# EAGLE schematic Room-Monitoring V.1.0 (EAGLE 7.2.0), part 1 of 2
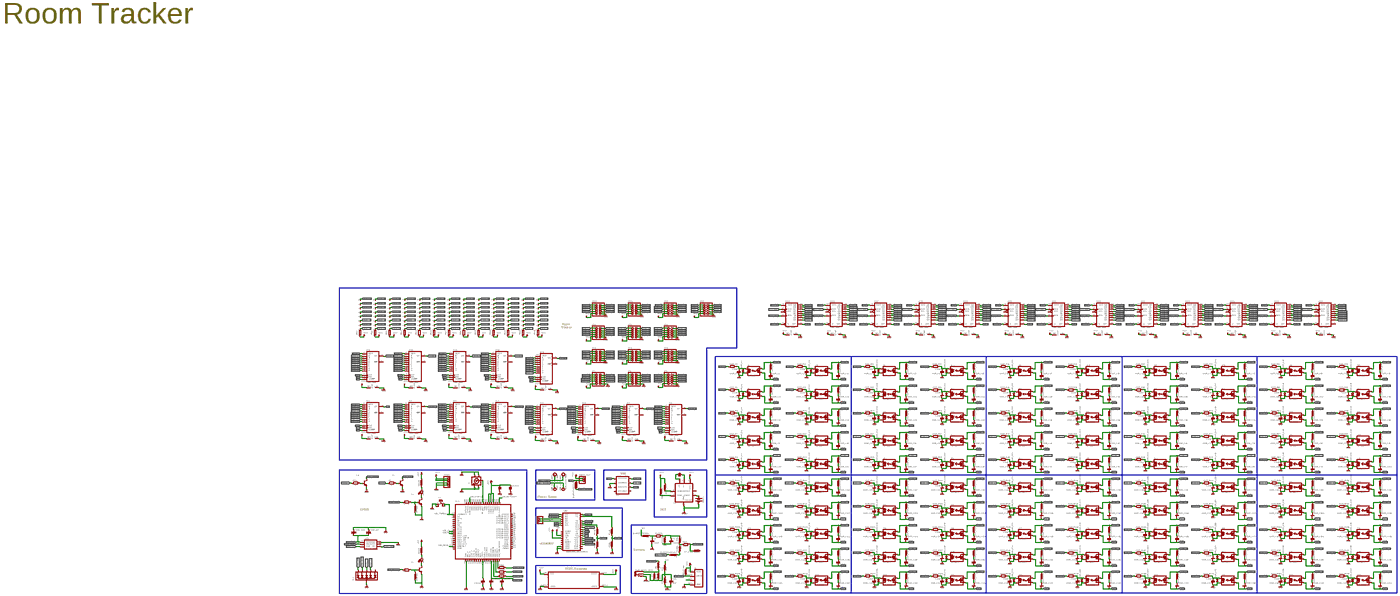
[diagram p0: schematic, sheet 1, overview]
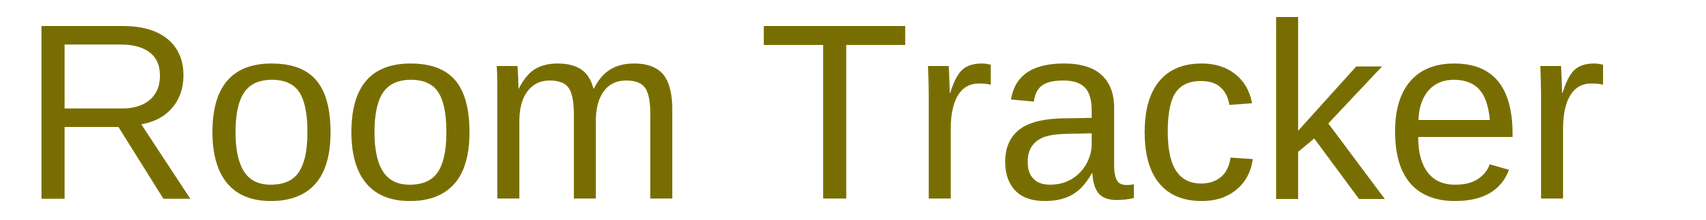
[diagram p1: schematic, sheet 1, part 1 of 5]
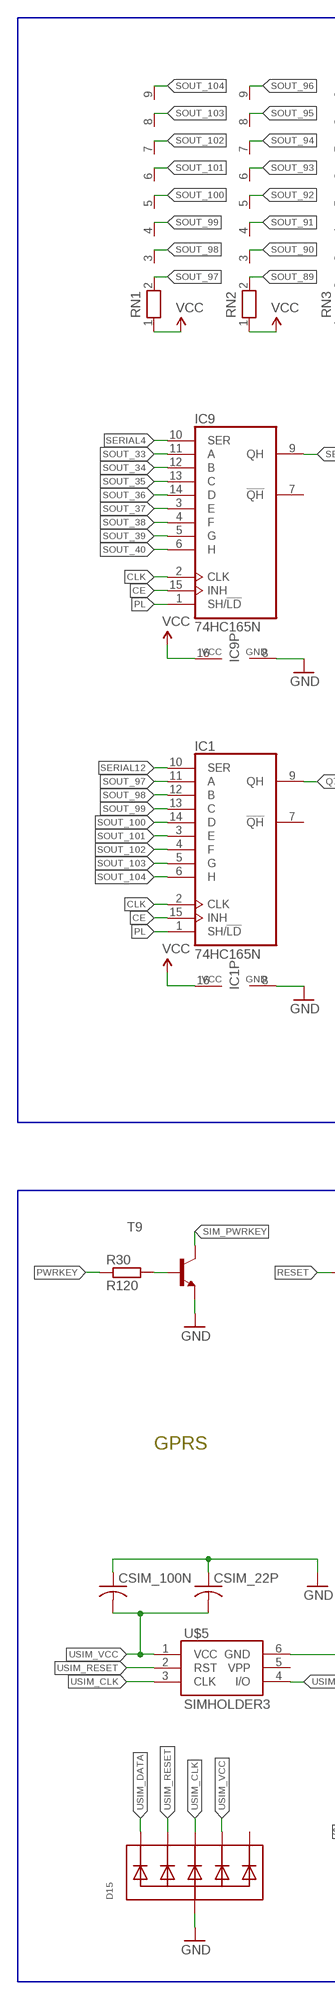
[diagram p2: schematic, sheet 1, part 2 of 5]
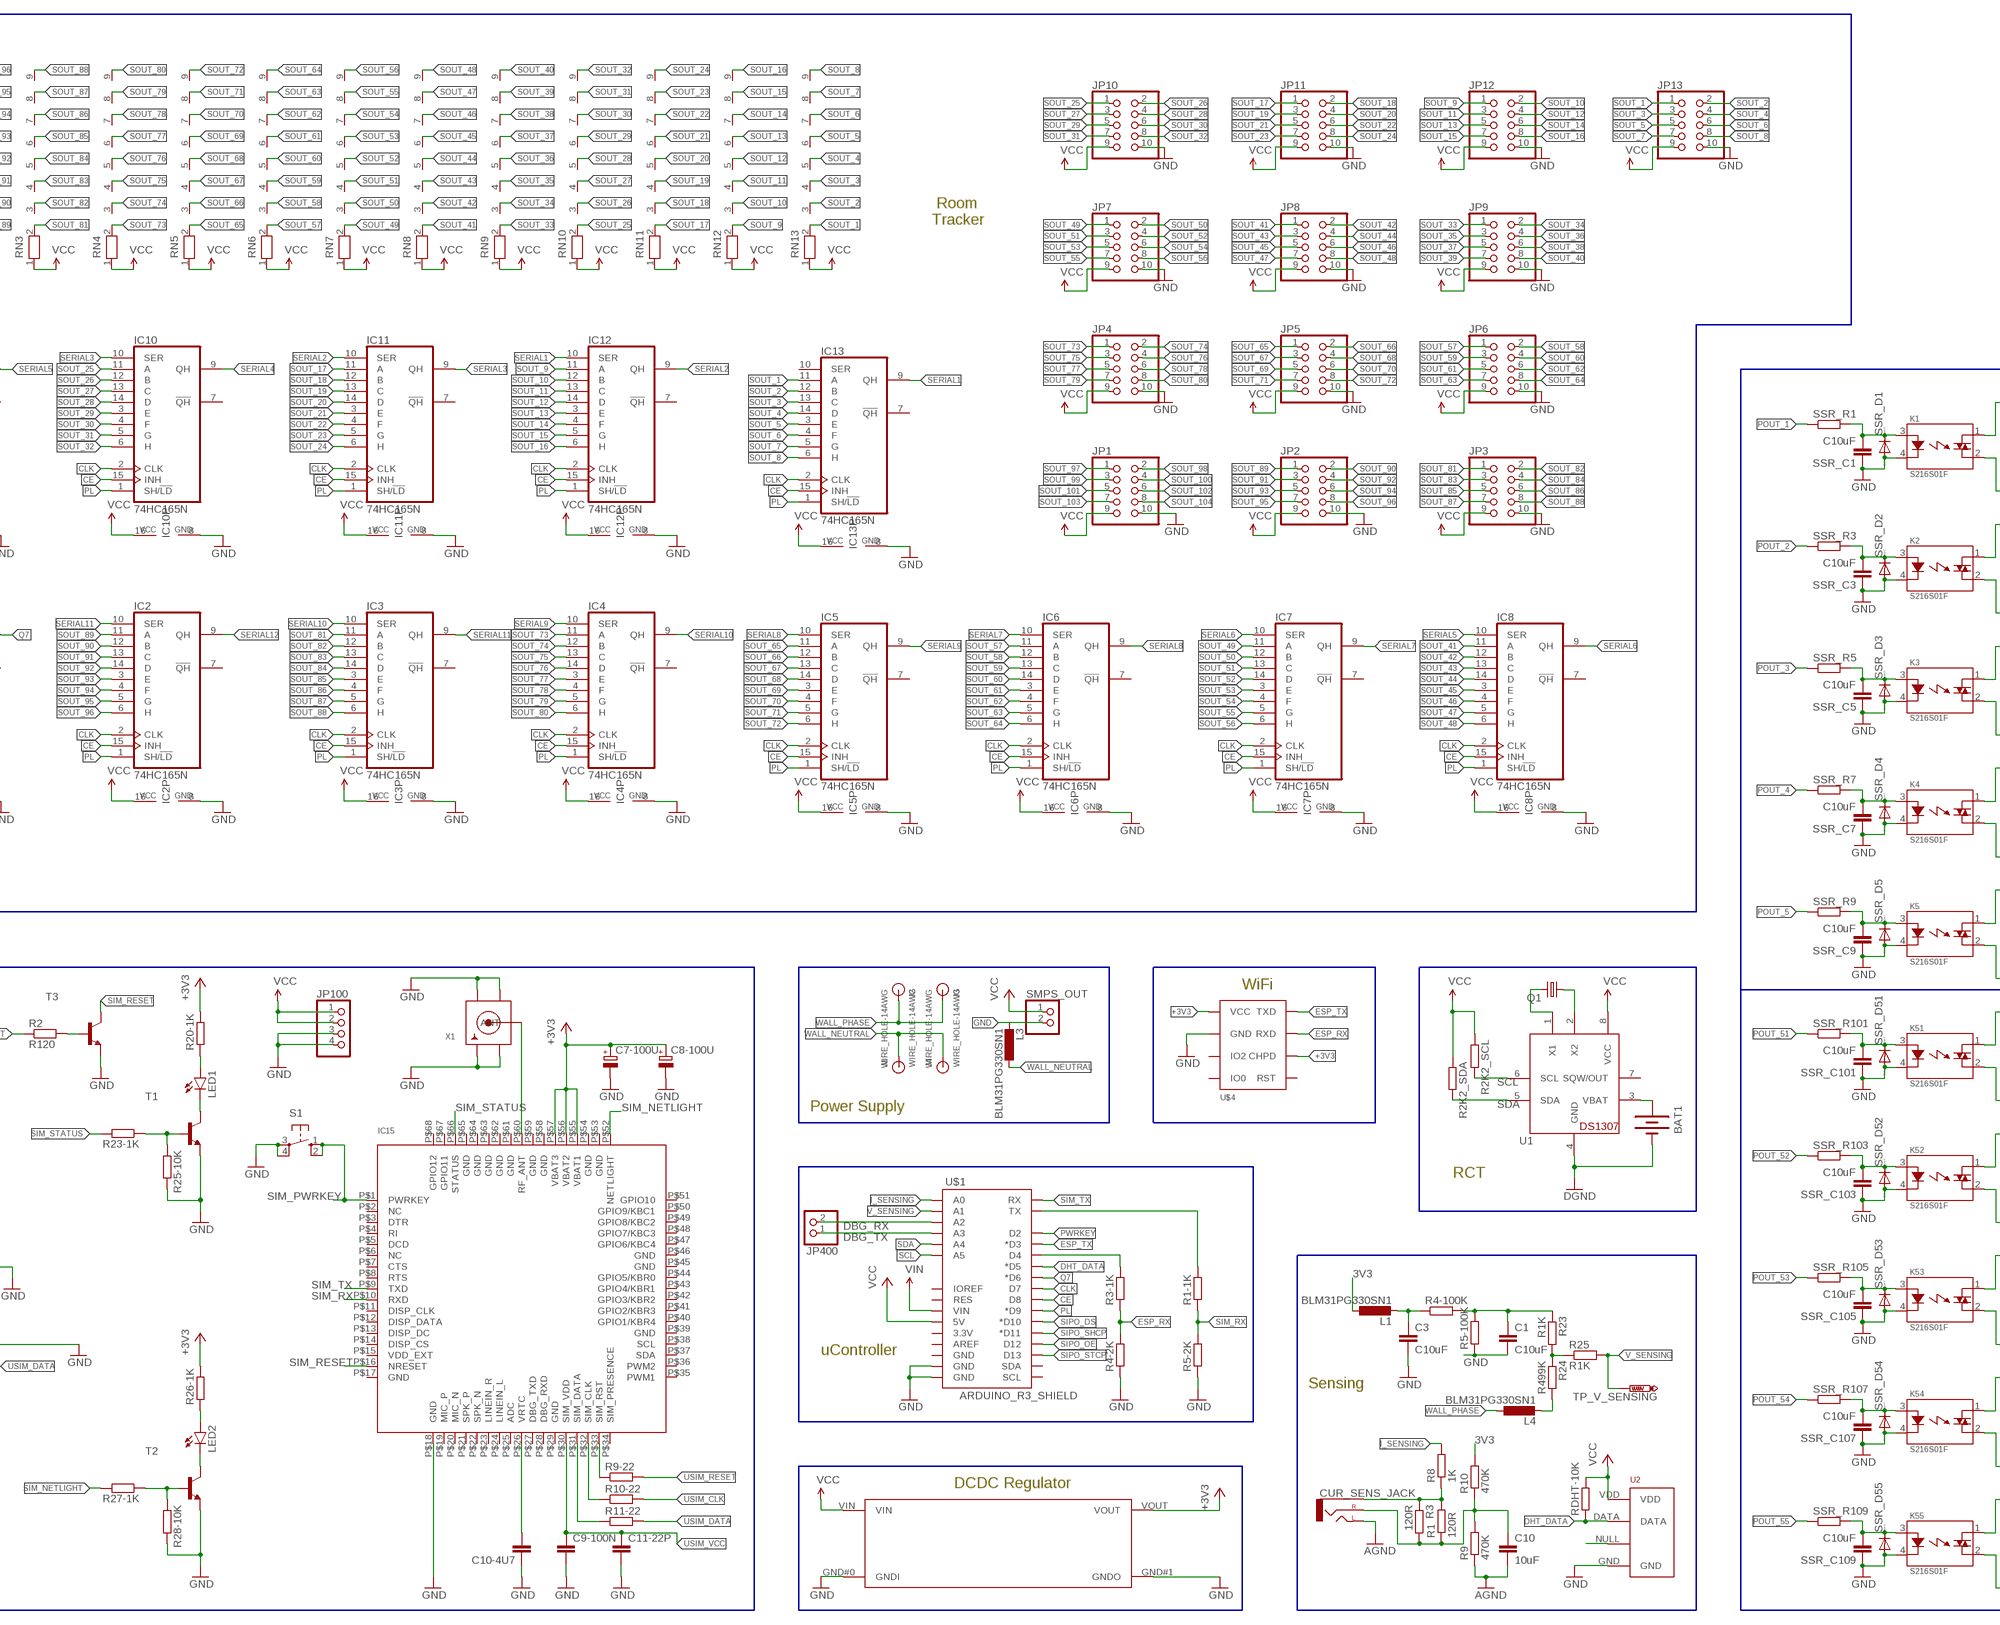
[diagram p3: schematic, sheet 1, part 3 of 5]
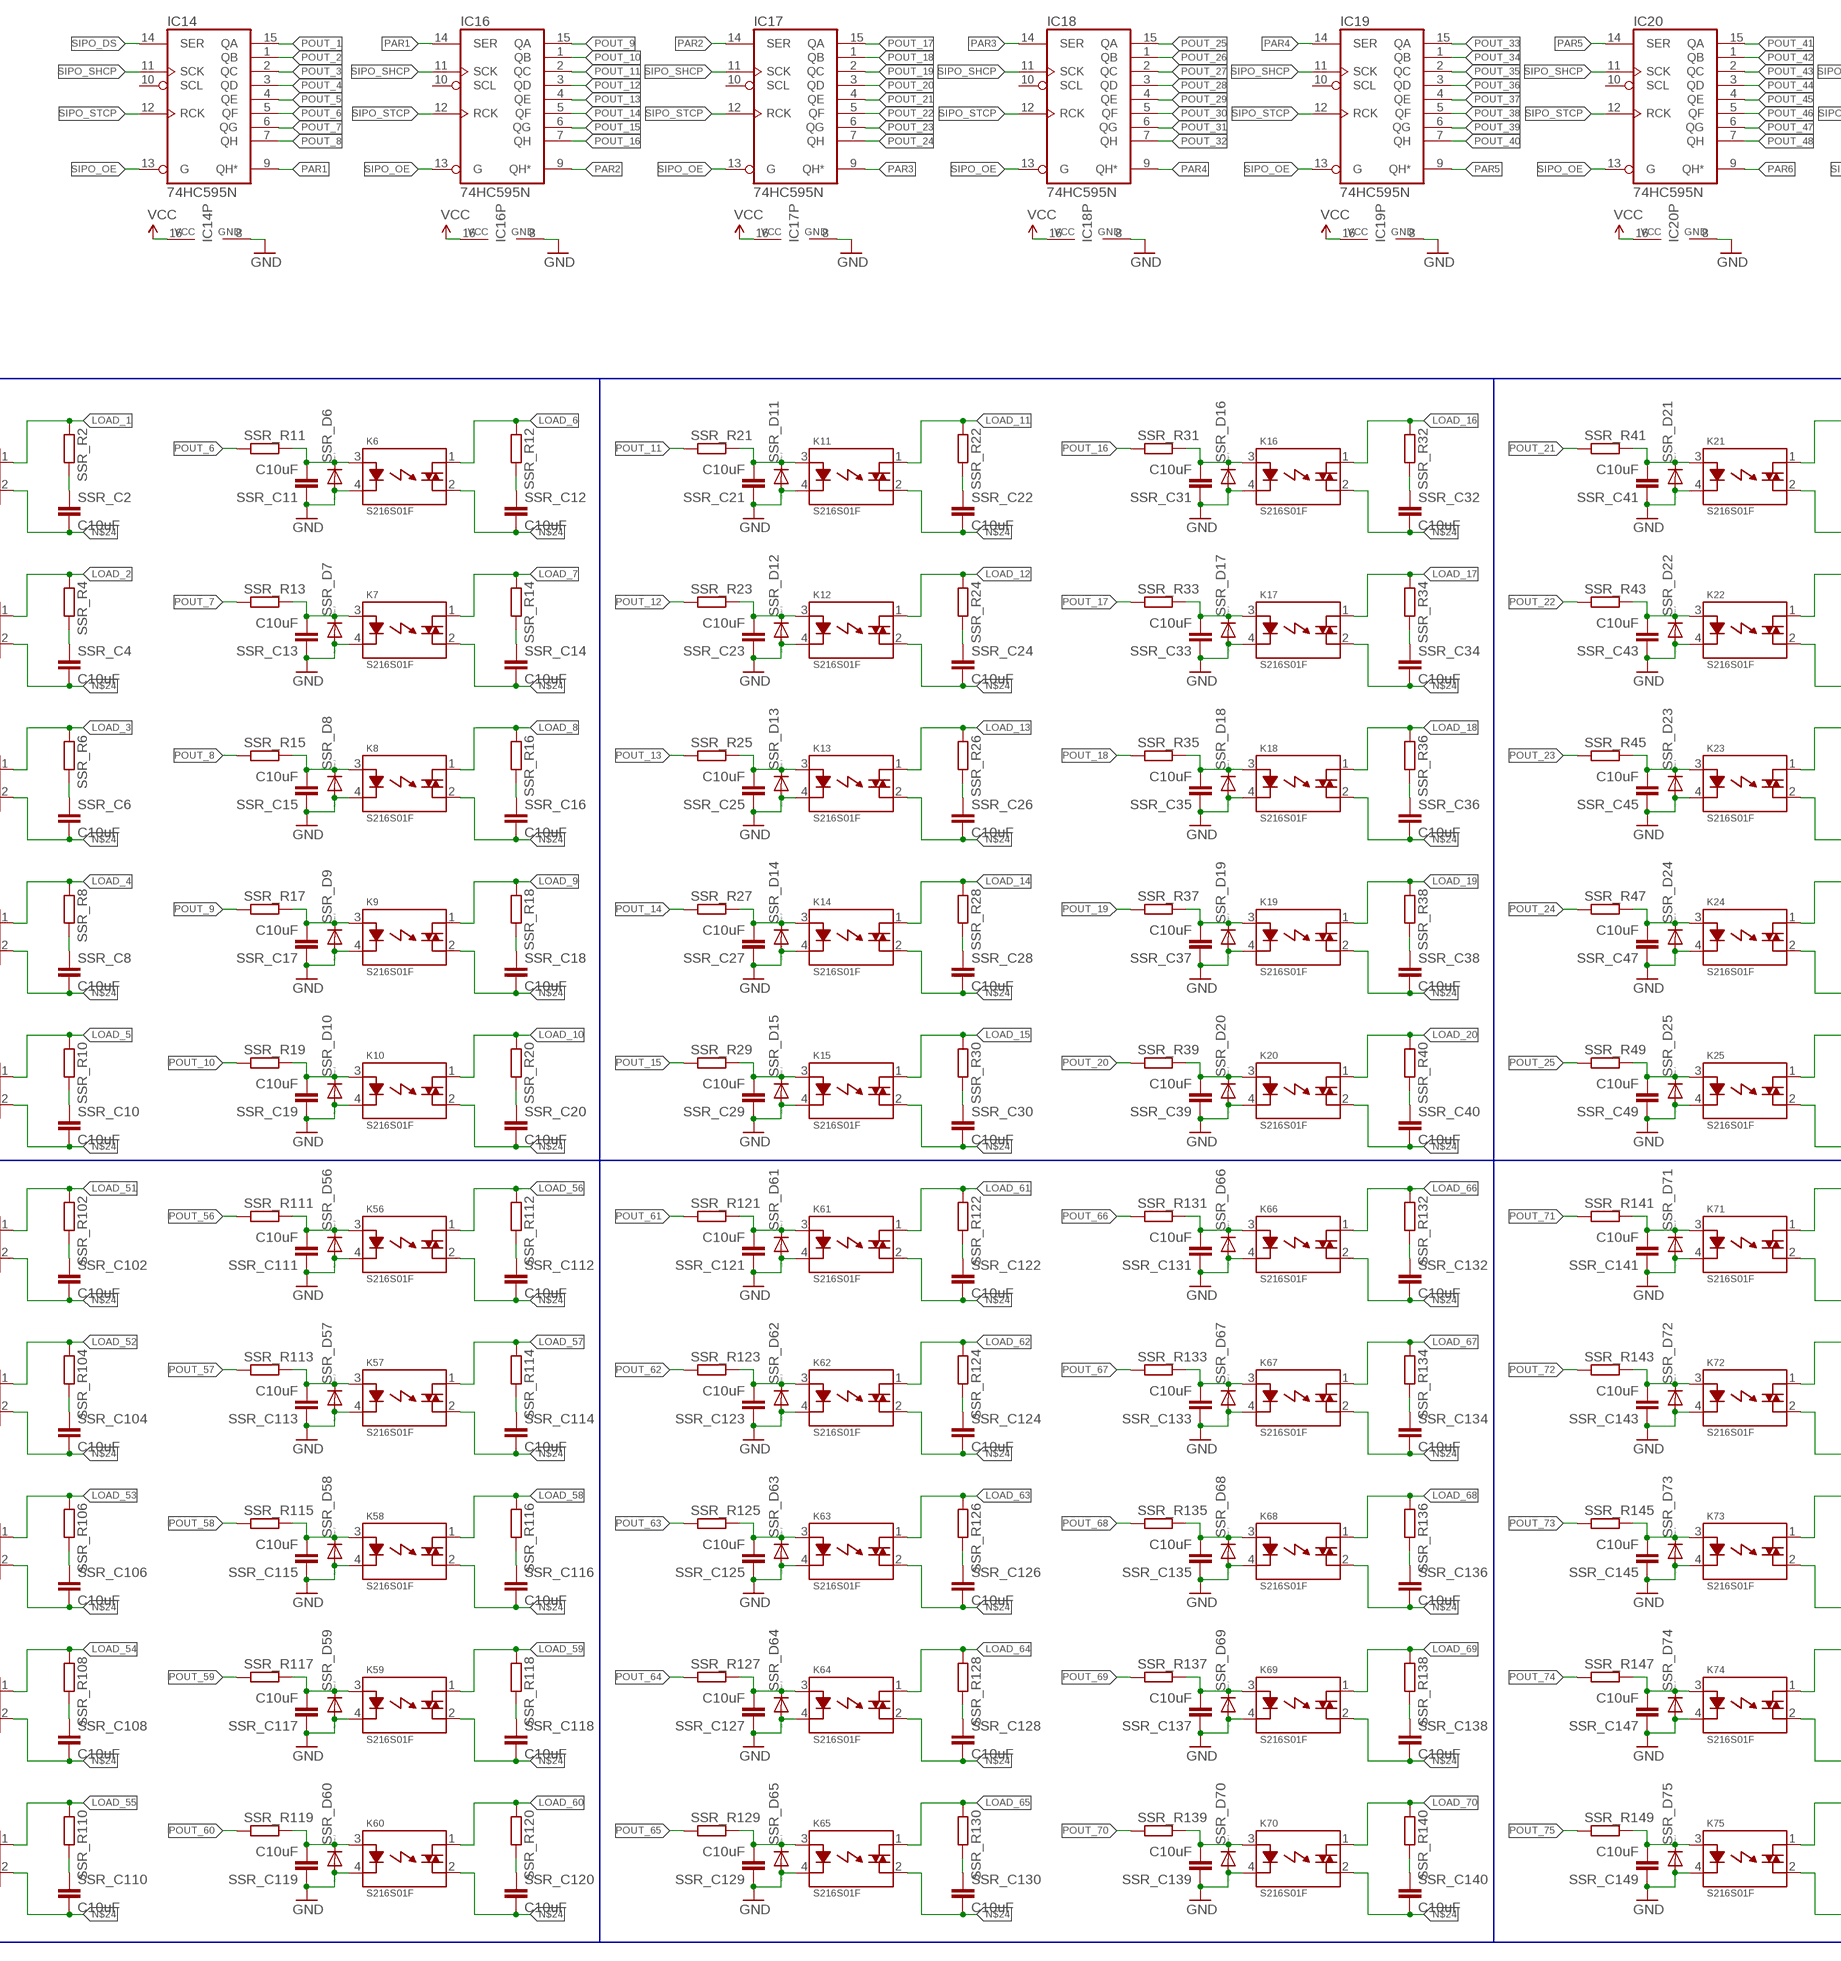
[diagram p4: schematic, sheet 1, part 4 of 5]
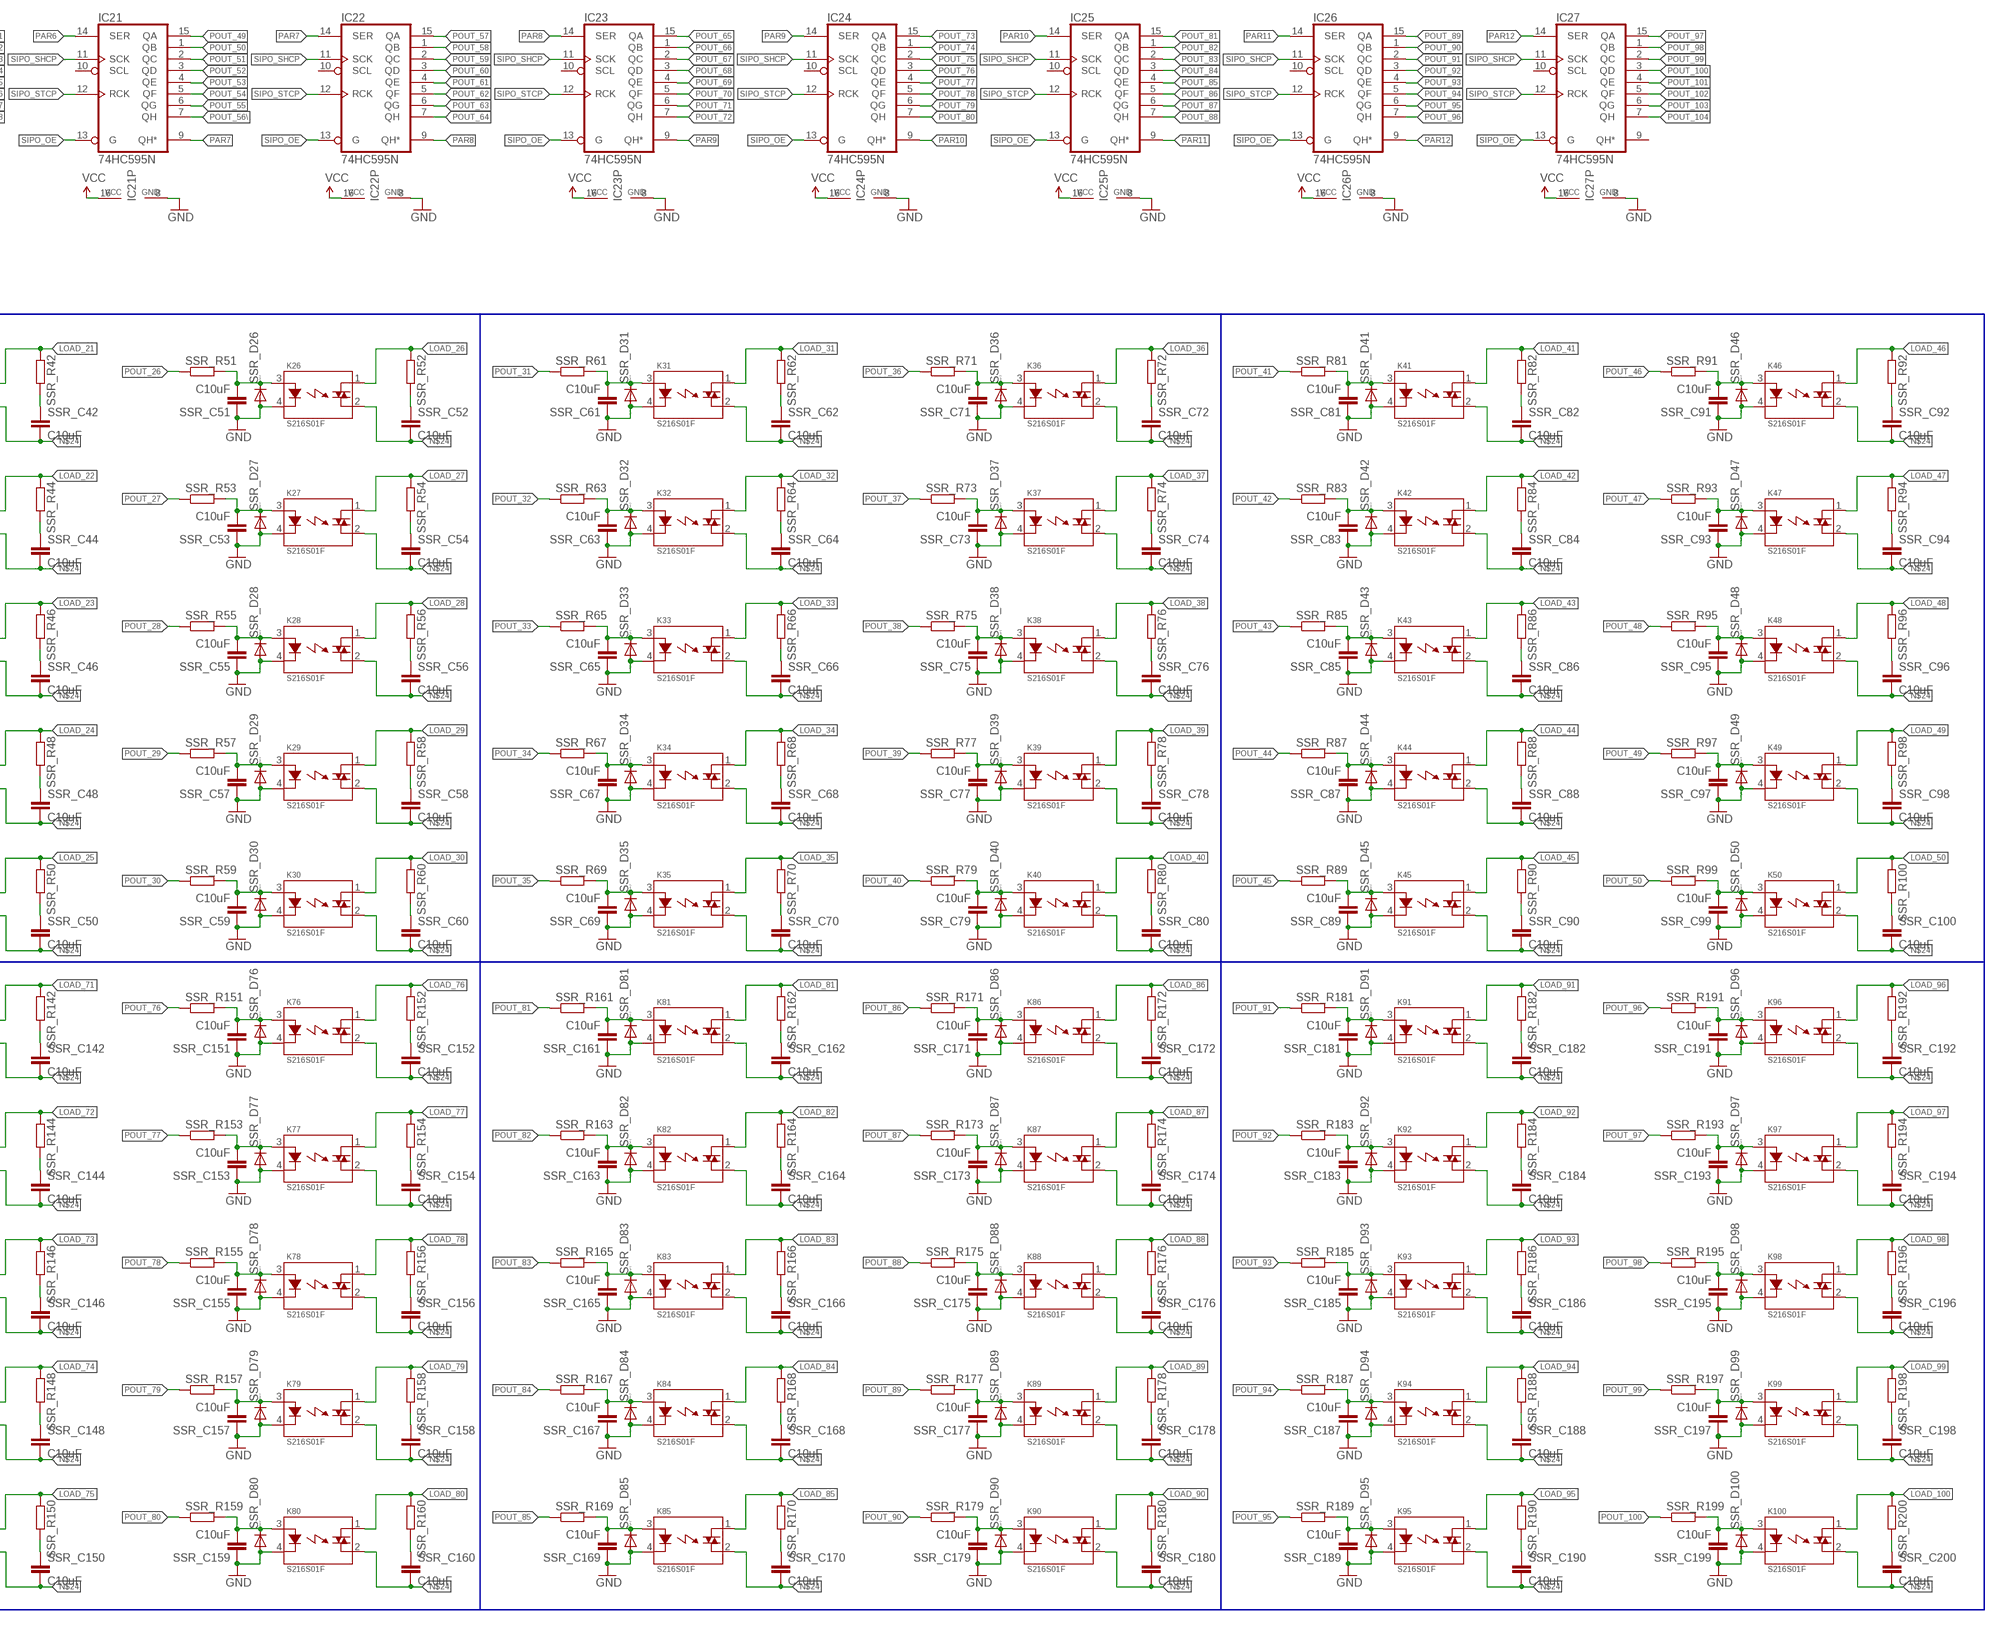
[diagram p5: schematic, sheet 1, part 5 of 5]

## Parts
BAT1  BATTERY20PTH  [BATTCOM_20MM_PTH]
C1  C10uF  C-EUC0805  [C0805]
C3  C10uF  C-EUC0805  [C0805]
C7-100U  CPOL-EU153CLV-0605  [153CLV-0605]
C8-100U  CPOL-EU153CLV-0605  [153CLV-0605]
C9-100N  C-EUC0603  [C0603]
C10  10uF  C-EUC0805  [C0805]
C10-4U7  C-EUC0603  [C0603]
C11-22P  C-EUC0603  [C0603]
CSIM_22P  C-USC0603K  [C0603K]
CSIM_100N  C-USC0603K  [C0603K]
CUR_SENS_JACK  AUDIO-JACKSMD2  [AUDIO-JACK-3.5MM-SMD]
D15  TVSARRAY_5LANE  [SOT363]
IC1  74HC165N  [DIL16]
IC2  74HC165N  [DIL16]
IC3  74HC165N  [DIL16]
IC4  74HC165N  [DIL16]
IC5  74HC165N  [DIL16]
IC6  74HC165N  [DIL16]
IC7  74HC165N  [DIL16]
IC8  74HC165N  [DIL16]
IC9  74HC165N  [DIL16]
IC10  74HC165N  [DIL16]
IC11  74HC165N  [DIL16]
IC12  74HC165N  [DIL16]
IC13  74HC165N  [DIL16]
IC14  74HC595N  [DIL16]
IC15  GSM_SIM900_LITERAL  [SIM900_SMT]
IC16  74HC595N  [DIL16]
IC17  74HC595N  [DIL16]
IC18  74HC595N  [DIL16]
IC19  74HC595N  [DIL16]
IC20  74HC595N  [DIL16]
IC21  74HC595N  [DIL16]
IC22  74HC595N  [DIL16]
IC23  74HC595N  [DIL16]
IC24  74HC595N  [DIL16]
IC25  74HC595N  [DIL16]
IC26  74HC595N  [DIL16]
IC27  74HC595N  [DIL16]
J1  WIRE_HOLE-14AWG  [WIRE_HOLE-14AWG]
J2  WIRE_HOLE-14AWG  [WIRE_HOLE-14AWG]
J3  WIRE_HOLE-14AWG  [WIRE_HOLE-14AWG]
J4  WIRE_HOLE-14AWG  [WIRE_HOLE-14AWG]
JP1  PINHD-2X5  [2X05]
JP2  PINHD-2X5  [2X05]
JP3  PINHD-2X5  [2X05]
JP4  PINHD-2X5  [2X05]
JP5  PINHD-2X5  [2X05]
JP6  PINHD-2X5  [2X05]
JP7  PINHD-2X5  [2X05]
JP8  PINHD-2X5  [2X05]
JP9  PINHD-2X5  [2X05]
JP10  PINHD-2X5  [2X05]
JP11  PINHD-2X5  [2X05]
JP12  PINHD-2X5  [2X05]
JP13  PINHD-2X5  [2X05]
JP100  PINHD-1X4  [1X04]
JP400  PINHD-1X2  [1X02]
K1  S216S01F  [RELAY_SX16S0X]
K2  S216S01F  [RELAY_SX16S0X]
K3  S216S01F  [RELAY_SX16S0X]
K4  S216S01F  [RELAY_SX16S0X]
K5  S216S01F  [RELAY_SX16S0X]
K6  S216S01F  [RELAY_SX16S0X]
K7  S216S01F  [RELAY_SX16S0X]
K8  S216S01F  [RELAY_SX16S0X]
K9  S216S01F  [RELAY_SX16S0X]
K10  S216S01F  [RELAY_SX16S0X]
K11  S216S01F  [RELAY_SX16S0X]
K12  S216S01F  [RELAY_SX16S0X]
K13  S216S01F  [RELAY_SX16S0X]
K14  S216S01F  [RELAY_SX16S0X]
K15  S216S01F  [RELAY_SX16S0X]
K16  S216S01F  [RELAY_SX16S0X]
K17  S216S01F  [RELAY_SX16S0X]
K18  S216S01F  [RELAY_SX16S0X]
K19  S216S01F  [RELAY_SX16S0X]
K20  S216S01F  [RELAY_SX16S0X]
K21  S216S01F  [RELAY_SX16S0X]
K22  S216S01F  [RELAY_SX16S0X]
K23  S216S01F  [RELAY_SX16S0X]
K24  S216S01F  [RELAY_SX16S0X]
K25  S216S01F  [RELAY_SX16S0X]
K26  S216S01F  [RELAY_SX16S0X]
K27  S216S01F  [RELAY_SX16S0X]
K28  S216S01F  [RELAY_SX16S0X]
K29  S216S01F  [RELAY_SX16S0X]
K30  S216S01F  [RELAY_SX16S0X]
K31  S216S01F  [RELAY_SX16S0X]
K32  S216S01F  [RELAY_SX16S0X]
K33  S216S01F  [RELAY_SX16S0X]
K34  S216S01F  [RELAY_SX16S0X]
K35  S216S01F  [RELAY_SX16S0X]
K36  S216S01F  [RELAY_SX16S0X]
K37  S216S01F  [RELAY_SX16S0X]
K38  S216S01F  [RELAY_SX16S0X]
K39  S216S01F  [RELAY_SX16S0X]
K40  S216S01F  [RELAY_SX16S0X]
K41  S216S01F  [RELAY_SX16S0X]
K42  S216S01F  [RELAY_SX16S0X]
K43  S216S01F  [RELAY_SX16S0X]
K44  S216S01F  [RELAY_SX16S0X]
K45  S216S01F  [RELAY_SX16S0X]
K46  S216S01F  [RELAY_SX16S0X]
K47  S216S01F  [RELAY_SX16S0X]
K48  S216S01F  [RELAY_SX16S0X]
K49  S216S01F  [RELAY_SX16S0X]
K50  S216S01F  [RELAY_SX16S0X]
K51  S216S01F  [RELAY_SX16S0X]
K52  S216S01F  [RELAY_SX16S0X]
K53  S216S01F  [RELAY_SX16S0X]
K54  S216S01F  [RELAY_SX16S0X]
K55  S216S01F  [RELAY_SX16S0X]
K56  S216S01F  [RELAY_SX16S0X]
K57  S216S01F  [RELAY_SX16S0X]
K58  S216S01F  [RELAY_SX16S0X]
K59  S216S01F  [RELAY_SX16S0X]
K60  S216S01F  [RELAY_SX16S0X]
K61  S216S01F  [RELAY_SX16S0X]
K62  S216S01F  [RELAY_SX16S0X]
K63  S216S01F  [RELAY_SX16S0X]
K64  S216S01F  [RELAY_SX16S0X]
K65  S216S01F  [RELAY_SX16S0X]
K66  S216S01F  [RELAY_SX16S0X]
K67  S216S01F  [RELAY_SX16S0X]
K68  S216S01F  [RELAY_SX16S0X]
K69  S216S01F  [RELAY_SX16S0X]
K70  S216S01F  [RELAY_SX16S0X]
K71  S216S01F  [RELAY_SX16S0X]
K72  S216S01F  [RELAY_SX16S0X]
K73  S216S01F  [RELAY_SX16S0X]
K74  S216S01F  [RELAY_SX16S0X]
K75  S216S01F  [RELAY_SX16S0X]
K76  S216S01F  [RELAY_SX16S0X]
K77  S216S01F  [RELAY_SX16S0X]
K78  S216S01F  [RELAY_SX16S0X]
K79  S216S01F  [RELAY_SX16S0X]
K80  S216S01F  [RELAY_SX16S0X]
K81  S216S01F  [RELAY_SX16S0X]
K82  S216S01F  [RELAY_SX16S0X]
K83  S216S01F  [RELAY_SX16S0X]
K84  S216S01F  [RELAY_SX16S0X]
K85  S216S01F  [RELAY_SX16S0X]
K86  S216S01F  [RELAY_SX16S0X]
K87  S216S01F  [RELAY_SX16S0X]
K88  S216S01F  [RELAY_SX16S0X]
K89  S216S01F  [RELAY_SX16S0X]
K90  S216S01F  [RELAY_SX16S0X]
K91  S216S01F  [RELAY_SX16S0X]
K92  S216S01F  [RELAY_SX16S0X]
K93  S216S01F  [RELAY_SX16S0X]
K94  S216S01F  [RELAY_SX16S0X]
K95  S216S01F  [RELAY_SX16S0X]
K96  S216S01F  [RELAY_SX16S0X]
K97  S216S01F  [RELAY_SX16S0X]
K98  S216S01F  [RELAY_SX16S0X]
K99  S216S01F  [RELAY_SX16S0X]
K100  S216S01F  [RELAY_SX16S0X]
L1  BLM31PG330SN1  L-EUL3216C  [L3216C]
L3  BLM31PG330SN1  L-EUL3216C  [L3216C]
L4  BLM31PG330SN1  L-EUL3216C  [L3216C]
LED1  LED-3MM-NO_SILK  [LED3MM-NS]
LED2  LED-3MM-NO_SILK  [LED3MM-NS]
Q1  CRYSTALTC26H  [TC26H]
R1  120R  R-EU_0204/7  [0204/7]
R1-1K  R-EU_R0603  [R0603]
R2  R120  R-EU_M0805  [M0805]
R2K2_SCL  R-EU_R0603  [R0603]
R2K2_SDA  R-EU_R0603  [R0603]
R3  120R  R-EU_R1206  [R1206]
R3-1K  R-EU_R0603  [R0603]
R4-2K  R-EU_R0603  [R0603]
R4-100K  R-EU_R0805  [R0805]
R5-2K  R-EU_R0603  [R0603]
R5-100K  R-EU_R0805  [R0805]
R8  1K  R-EU_R0805  [R0805]
R9  470K  R-EU_R0805  [R0805]
R9-22  R-EU_R0603  [R0603]
R10  470K  R-EU_R0805  [R0805]
R10-22  R-EU_R0603  [R0603]
R11-22  R-EU_R0603  [R0603]
R20-1K  R-EU_R0603  [R0603]
R23  R1K  R-EU_R0805  [R0805]
R23-1K  R-EU_R0603  [R0603]
R24  R499K  R-EU_R0805  [R0805]
R25  R1K  R-EU_R0805  [R0805]
R25-10K  R-EU_R0603  [R0603]
R26-1K  R-EU_R0603  [R0603]
R27-1K  R-EU_R0603  [R0603]
R28-10K  R-EU_R0603  [R0603]
R30  R120  R-EU_M0805  [M0805]
RDHT-10K  R-EU_R0603  [R0603]
RN1  RN08  [RN-9]
RN2  RN08  [RN-9]
RN3  RN08  [RN-9]
RN4  RN08  [RN-9]
RN5  RN08  [RN-9]
RN6  RN08  [RN-9]
RN7  RN08  [RN-9]
RN8  RN08  [RN-9]
RN9  RN08  [RN-9]
RN10  RN08  [RN-9]
RN11  RN08  [RN-9]
RN12  RN08  [RN-9]
RN13  RN08  [RN-9]
S1  10-XX  [B3F-10XX]
SMPS_OUT  PINHD-1X2  [1X02]
SSR_C1  C10uF  C-EUC0805  [C0805]
SSR_C2  C10uF  C-EUC0805  [C0805]
SSR_C3  C10uF  C-EUC0805  [C0805]
SSR_C4  C10uF  C-EUC0805  [C0805]
SSR_C5  C10uF  C-EUC0805  [C0805]
SSR_C6  C10uF  C-EUC0805  [C0805]
SSR_C7  C10uF  C-EUC0805  [C0805]
SSR_C8  C10uF  C-EUC0805  [C0805]
SSR_C9  C10uF  C-EUC0805  [C0805]
SSR_C10  C10uF  C-EUC0805  [C0805]
SSR_C11  C10uF  C-EUC0805  [C0805]
SSR_C12  C10uF  C-EUC0805  [C0805]
SSR_C13  C10uF  C-EUC0805  [C0805]
SSR_C14  C10uF  C-EUC0805  [C0805]
SSR_C15  C10uF  C-EUC0805  [C0805]
SSR_C16  C10uF  C-EUC0805  [C0805]
SSR_C17  C10uF  C-EUC0805  [C0805]
SSR_C18  C10uF  C-EUC0805  [C0805]
SSR_C19  C10uF  C-EUC0805  [C0805]
SSR_C20  C10uF  C-EUC0805  [C0805]
SSR_C21  C10uF  C-EUC0805  [C0805]
SSR_C22  C10uF  C-EUC0805  [C0805]
SSR_C23  C10uF  C-EUC0805  [C0805]
SSR_C24  C10uF  C-EUC0805  [C0805]
SSR_C25  C10uF  C-EUC0805  [C0805]
SSR_C26  C10uF  C-EUC0805  [C0805]
SSR_C27  C10uF  C-EUC0805  [C0805]
SSR_C28  C10uF  C-EUC0805  [C0805]
SSR_C29  C10uF  C-EUC0805  [C0805]
SSR_C30  C10uF  C-EUC0805  [C0805]
SSR_C31  C10uF  C-EUC0805  [C0805]
SSR_C32  C10uF  C-EUC0805  [C0805]
SSR_C33  C10uF  C-EUC0805  [C0805]
SSR_C34  C10uF  C-EUC0805  [C0805]
SSR_C35  C10uF  C-EUC0805  [C0805]
SSR_C36  C10uF  C-EUC0805  [C0805]
SSR_C37  C10uF  C-EUC0805  [C0805]
SSR_C38  C10uF  C-EUC0805  [C0805]
SSR_C39  C10uF  C-EUC0805  [C0805]
SSR_C40  C10uF  C-EUC0805  [C0805]
SSR_C41  C10uF  C-EUC0805  [C0805]
SSR_C42  C10uF  C-EUC0805  [C0805]
SSR_C43  C10uF  C-EUC0805  [C0805]
SSR_C44  C10uF  C-EUC0805  [C0805]
SSR_C45  C10uF  C-EUC0805  [C0805]
SSR_C46  C10uF  C-EUC0805  [C0805]
SSR_C47  C10uF  C-EUC0805  [C0805]
SSR_C48  C10uF  C-EUC0805  [C0805]
SSR_C49  C10uF  C-EUC0805  [C0805]
SSR_C50  C10uF  C-EUC0805  [C0805]
SSR_C51  C10uF  C-EUC0805  [C0805]
SSR_C52  C10uF  C-EUC0805  [C0805]
SSR_C53  C10uF  C-EUC0805  [C0805]
SSR_C54  C10uF  C-EUC0805  [C0805]
SSR_C55  C10uF  C-EUC0805  [C0805]
SSR_C56  C10uF  C-EUC0805  [C0805]
SSR_C57  C10uF  C-EUC0805  [C0805]
SSR_C58  C10uF  C-EUC0805  [C0805]
SSR_C59  C10uF  C-EUC0805  [C0805]
SSR_C60  C10uF  C-EUC0805  [C0805]
SSR_C61  C10uF  C-EUC0805  [C0805]
SSR_C62  C10uF  C-EUC0805  [C0805]
SSR_C63  C10uF  C-EUC0805  [C0805]
SSR_C64  C10uF  C-EUC0805  [C0805]
SSR_C65  C10uF  C-EUC0805  [C0805]
SSR_C66  C10uF  C-EUC0805  [C0805]
SSR_C67  C10uF  C-EUC0805  [C0805]
SSR_C68  C10uF  C-EUC0805  [C0805]
SSR_C69  C10uF  C-EUC0805  [C0805]
SSR_C70  C10uF  C-EUC0805  [C0805]
SSR_C71  C10uF  C-EUC0805  [C0805]
SSR_C72  C10uF  C-EUC0805  [C0805]
SSR_C73  C10uF  C-EUC0805  [C0805]
SSR_C74  C10uF  C-EUC0805  [C0805]
SSR_C75  C10uF  C-EUC0805  [C0805]
SSR_C76  C10uF  C-EUC0805  [C0805]
SSR_C77  C10uF  C-EUC0805  [C0805]
SSR_C78  C10uF  C-EUC0805  [C0805]
SSR_C79  C10uF  C-EUC0805  [C0805]
SSR_C80  C10uF  C-EUC0805  [C0805]
SSR_C81  C10uF  C-EUC0805  [C0805]
SSR_C82  C10uF  C-EUC0805  [C0805]
SSR_C83  C10uF  C-EUC0805  [C0805]
SSR_C84  C10uF  C-EUC0805  [C0805]
SSR_C85  C10uF  C-EUC0805  [C0805]
SSR_C86  C10uF  C-EUC0805  [C0805]
SSR_C87  C10uF  C-EUC0805  [C0805]
SSR_C88  C10uF  C-EUC0805  [C0805]
SSR_C89  C10uF  C-EUC0805  [C0805]
SSR_C90  C10uF  C-EUC0805  [C0805]
SSR_C91  C10uF  C-EUC0805  [C0805]
SSR_C92  C10uF  C-EUC0805  [C0805]
SSR_C93  C10uF  C-EUC0805  [C0805]
SSR_C94  C10uF  C-EUC0805  [C0805]
SSR_C95  C10uF  C-EUC0805  [C0805]
SSR_C96  C10uF  C-EUC0805  [C0805]
SSR_C97  C10uF  C-EUC0805  [C0805]
SSR_C98  C10uF  C-EUC0805  [C0805]
SSR_C99  C10uF  C-EUC0805  [C0805]
SSR_C100  C10uF  C-EUC0805  [C0805]
SSR_C101  C10uF  C-EUC0805  [C0805]
SSR_C102  C10uF  C-EUC0805  [C0805]
SSR_C103  C10uF  C-EUC0805  [C0805]
SSR_C104  C10uF  C-EUC0805  [C0805]
SSR_C105  C10uF  C-EUC0805  [C0805]
SSR_C106  C10uF  C-EUC0805  [C0805]
SSR_C107  C10uF  C-EUC0805  [C0805]
SSR_C108  C10uF  C-EUC0805  [C0805]
SSR_C109  C10uF  C-EUC0805  [C0805]
SSR_C110  C10uF  C-EUC0805  [C0805]
SSR_C111  C10uF  C-EUC0805  [C0805]
SSR_C112  C10uF  C-EUC0805  [C0805]
SSR_C113  C10uF  C-EUC0805  [C0805]
SSR_C114  C10uF  C-EUC0805  [C0805]
SSR_C115  C10uF  C-EUC0805  [C0805]
SSR_C116  C10uF  C-EUC0805  [C0805]
SSR_C117  C10uF  C-EUC0805  [C0805]
SSR_C118  C10uF  C-EUC0805  [C0805]
SSR_C119  C10uF  C-EUC0805  [C0805]
SSR_C120  C10uF  C-EUC0805  [C0805]
SSR_C121  C10uF  C-EUC0805  [C0805]
SSR_C122  C10uF  C-EUC0805  [C0805]
SSR_C123  C10uF  C-EUC0805  [C0805]
SSR_C124  C10uF  C-EUC0805  [C0805]
SSR_C125  C10uF  C-EUC0805  [C0805]
SSR_C126  C10uF  C-EUC0805  [C0805]
SSR_C127  C10uF  C-EUC0805  [C0805]
SSR_C128  C10uF  C-EUC0805  [C0805]
SSR_C129  C10uF  C-EUC0805  [C0805]
SSR_C130  C10uF  C-EUC0805  [C0805]
SSR_C131  C10uF  C-EUC0805  [C0805]
SSR_C132  C10uF  C-EUC0805  [C0805]
SSR_C133  C10uF  C-EUC0805  [C0805]
SSR_C134  C10uF  C-EUC0805  [C0805]
SSR_C135  C10uF  C-EUC0805  [C0805]
SSR_C136  C10uF  C-EUC0805  [C0805]
SSR_C137  C10uF  C-EUC0805  [C0805]
SSR_C138  C10uF  C-EUC0805  [C0805]
SSR_C139  C10uF  C-EUC0805  [C0805]
SSR_C140  C10uF  C-EUC0805  [C0805]
SSR_C141  C10uF  C-EUC0805  [C0805]
SSR_C142  C10uF  C-EUC0805  [C0805]
SSR_C143  C10uF  C-EUC0805  [C0805]
SSR_C144  C10uF  C-EUC0805  [C0805]
SSR_C145  C10uF  C-EUC0805  [C0805]
SSR_C146  C10uF  C-EUC0805  [C0805]
SSR_C147  C10uF  C-EUC0805  [C0805]
SSR_C148  C10uF  C-EUC0805  [C0805]
SSR_C149  C10uF  C-EUC0805  [C0805]
SSR_C150  C10uF  C-EUC0805  [C0805]
SSR_C151  C10uF  C-EUC0805  [C0805]
SSR_C152  C10uF  C-EUC0805  [C0805]
SSR_C153  C10uF  C-EUC0805  [C0805]
SSR_C154  C10uF  C-EUC0805  [C0805]
SSR_C155  C10uF  C-EUC0805  [C0805]
SSR_C156  C10uF  C-EUC0805  [C0805]
SSR_C157  C10uF  C-EUC0805  [C0805]
SSR_C158  C10uF  C-EUC0805  [C0805]
SSR_C159  C10uF  C-EUC0805  [C0805]
SSR_C160  C10uF  C-EUC0805  [C0805]
SSR_C161  C10uF  C-EUC0805  [C0805]
SSR_C162  C10uF  C-EUC0805  [C0805]
SSR_C163  C10uF  C-EUC0805  [C0805]
SSR_C164  C10uF  C-EUC0805  [C0805]
SSR_C165  C10uF  C-EUC0805  [C0805]
SSR_C166  C10uF  C-EUC0805  [C0805]
SSR_C167  C10uF  C-EUC0805  [C0805]
SSR_C168  C10uF  C-EUC0805  [C0805]
SSR_C169  C10uF  C-EUC0805  [C0805]
SSR_C170  C10uF  C-EUC0805  [C0805]
SSR_C171  C10uF  C-EUC0805  [C0805]
SSR_C172  C10uF  C-EUC0805  [C0805]
SSR_C173  C10uF  C-EUC0805  [C0805]
SSR_C174  C10uF  C-EUC0805  [C0805]
SSR_C175  C10uF  C-EUC0805  [C0805]
SSR_C176  C10uF  C-EUC0805  [C0805]
SSR_C177  C10uF  C-EUC0805  [C0805]
SSR_C178  C10uF  C-EUC0805  [C0805]
SSR_C179  C10uF  C-EUC0805  [C0805]
SSR_C180  C10uF  C-EUC0805  [C0805]
SSR_C181  C10uF  C-EUC0805  [C0805]
SSR_C182  C10uF  C-EUC0805  [C0805]
SSR_C183  C10uF  C-EUC0805  [C0805]
SSR_C184  C10uF  C-EUC0805  [C0805]
SSR_C185  C10uF  C-EUC0805  [C0805]
SSR_C186  C10uF  C-EUC0805  [C0805]
SSR_C187  C10uF  C-EUC0805  [C0805]
SSR_C188  C10uF  C-EUC0805  [C0805]
SSR_C189  C10uF  C-EUC0805  [C0805]
SSR_C190  C10uF  C-EUC0805  [C0805]
SSR_C191  C10uF  C-EUC0805  [C0805]
SSR_C192  C10uF  C-EUC0805  [C0805]
SSR_C193  C10uF  C-EUC0805  [C0805]
SSR_C194  C10uF  C-EUC0805  [C0805]
SSR_C195  C10uF  C-EUC0805  [C0805]
SSR_C196  C10uF  C-EUC0805  [C0805]
SSR_C197  C10uF  C-EUC0805  [C0805]
SSR_C198  C10uF  C-EUC0805  [C0805]
SSR_C199  C10uF  C-EUC0805  [C0805]
SSR_C200  C10uF  C-EUC0805  [C0805]
SSR_D1  DIODE-DO214AC  [DO214AC]
SSR_D2  DIODE-DO214AC  [DO214AC]
SSR_D3  DIODE-DO214AC  [DO214AC]
SSR_D4  DIODE-DO214AC  [DO214AC]
SSR_D5  DIODE-DO214AC  [DO214AC]
SSR_D6  DIODE-DO214AC  [DO214AC]
SSR_D7  DIODE-DO214AC  [DO214AC]
SSR_D8  DIODE-DO214AC  [DO214AC]
SSR_D9  DIODE-DO214AC  [DO214AC]
SSR_D10  DIODE-DO214AC  [DO214AC]
SSR_D11  DIODE-DO214AC  [DO214AC]
SSR_D12  DIODE-DO214AC  [DO214AC]
SSR_D13  DIODE-DO214AC  [DO214AC]
SSR_D14  DIODE-DO214AC  [DO214AC]
SSR_D15  DIODE-DO214AC  [DO214AC]
SSR_D16  DIODE-DO214AC  [DO214AC]
SSR_D17  DIODE-DO214AC  [DO214AC]
SSR_D18  DIODE-DO214AC  [DO214AC]
SSR_D19  DIODE-DO214AC  [DO214AC]
SSR_D20  DIODE-DO214AC  [DO214AC]
SSR_D21  DIODE-DO214AC  [DO214AC]
SSR_D22  DIODE-DO214AC  [DO214AC]
SSR_D23  DIODE-DO214AC  [DO214AC]
SSR_D24  DIODE-DO214AC  [DO214AC]
SSR_D25  DIODE-DO214AC  [DO214AC]
SSR_D26  DIODE-DO214AC  [DO214AC]
SSR_D27  DIODE-DO214AC  [DO214AC]
SSR_D28  DIODE-DO214AC  [DO214AC]
SSR_D29  DIODE-DO214AC  [DO214AC]
SSR_D30  DIODE-DO214AC  [DO214AC]
SSR_D31  DIODE-DO214AC  [DO214AC]
SSR_D32  DIODE-DO214AC  [DO214AC]
SSR_D33  DIODE-DO214AC  [DO214AC]
SSR_D34  DIODE-DO214AC  [DO214AC]
SSR_D35  DIODE-DO214AC  [DO214AC]
SSR_D36  DIODE-DO214AC  [DO214AC]
SSR_D37  DIODE-DO214AC  [DO214AC]
SSR_D38  DIODE-DO214AC  [DO214AC]
SSR_D39  DIODE-DO214AC  [DO214AC]
SSR_D40  DIODE-DO214AC  [DO214AC]
SSR_D41  DIODE-DO214AC  [DO214AC]
SSR_D42  DIODE-DO214AC  [DO214AC]
SSR_D43  DIODE-DO214AC  [DO214AC]
SSR_D44  DIODE-DO214AC  [DO214AC]
SSR_D45  DIODE-DO214AC  [DO214AC]
SSR_D46  DIODE-DO214AC  [DO214AC]
SSR_D47  DIODE-DO214AC  [DO214AC]
SSR_D48  DIODE-DO214AC  [DO214AC]
SSR_D49  DIODE-DO214AC  [DO214AC]
SSR_D50  DIODE-DO214AC  [DO214AC]
SSR_D51  DIODE-DO214AC  [DO214AC]
SSR_D52  DIODE-DO214AC  [DO214AC]
SSR_D53  DIODE-DO214AC  [DO214AC]
SSR_D54  DIODE-DO214AC  [DO214AC]
SSR_D55  DIODE-DO214AC  [DO214AC]
SSR_D56  DIODE-DO214AC  [DO214AC]
SSR_D57  DIODE-DO214AC  [DO214AC]
SSR_D58  DIODE-DO214AC  [DO214AC]
SSR_D59  DIODE-DO214AC  [DO214AC]
SSR_D60  DIODE-DO214AC  [DO214AC]
SSR_D61  DIODE-DO214AC  [DO214AC]
SSR_D62  DIODE-DO214AC  [DO214AC]
SSR_D63  DIODE-DO214AC  [DO214AC]
SSR_D64  DIODE-DO214AC  [DO214AC]
SSR_D65  DIODE-DO214AC  [DO214AC]
SSR_D66  DIODE-DO214AC  [DO214AC]
SSR_D67  DIODE-DO214AC  [DO214AC]
SSR_D68  DIODE-DO214AC  [DO214AC]
SSR_D69  DIODE-DO214AC  [DO214AC]
SSR_D70  DIODE-DO214AC  [DO214AC]
SSR_D71  DIODE-DO214AC  [DO214AC]
SSR_D72  DIODE-DO214AC  [DO214AC]
SSR_D73  DIODE-DO214AC  [DO214AC]
SSR_D74  DIODE-DO214AC  [DO214AC]
SSR_D75  DIODE-DO214AC  [DO214AC]
SSR_D76  DIODE-DO214AC  [DO214AC]
SSR_D77  DIODE-DO214AC  [DO214AC]
SSR_D78  DIODE-DO214AC  [DO214AC]
SSR_D79  DIODE-DO214AC  [DO214AC]
SSR_D80  DIODE-DO214AC  [DO214AC]
SSR_D81  DIODE-DO214AC  [DO214AC]
SSR_D82  DIODE-DO214AC  [DO214AC]
SSR_D83  DIODE-DO214AC  [DO214AC]
SSR_D84  DIODE-DO214AC  [DO214AC]
SSR_D85  DIODE-DO214AC  [DO214AC]
SSR_D86  DIODE-DO214AC  [DO214AC]
SSR_D87  DIODE-DO214AC  [DO214AC]
SSR_D88  DIODE-DO214AC  [DO214AC]
SSR_D89  DIODE-DO214AC  [DO214AC]
SSR_D90  DIODE-DO214AC  [DO214AC]
SSR_D91  DIODE-DO214AC  [DO214AC]
SSR_D92  DIODE-DO214AC  [DO214AC]
SSR_D93  DIODE-DO214AC  [DO214AC]
SSR_D94  DIODE-DO214AC  [DO214AC]
SSR_D95  DIODE-DO214AC  [DO214AC]
SSR_D96  DIODE-DO214AC  [DO214AC]
SSR_D97  DIODE-DO214AC  [DO214AC]
SSR_D98  DIODE-DO214AC  [DO214AC]
SSR_D99  DIODE-DO214AC  [DO214AC]
SSR_D100  DIODE-DO214AC  [DO214AC]
SSR_R1  R-EU_R0603  [R0603]
SSR_R2  R-EU_R0603  [R0603]
SSR_R3  R-EU_R0603  [R0603]
SSR_R4  R-EU_R0603  [R0603]
SSR_R5  R-EU_R0603  [R0603]
SSR_R6  R-EU_R0603  [R0603]
SSR_R7  R-EU_R0603  [R0603]
SSR_R8  R-EU_R0603  [R0603]
SSR_R9  R-EU_R0603  [R0603]
SSR_R10  R-EU_R0603  [R0603]
SSR_R11  R-EU_R0603  [R0603]
SSR_R12  R-EU_R0603  [R0603]
SSR_R13  R-EU_R0603  [R0603]
SSR_R14  R-EU_R0603  [R0603]
SSR_R15  R-EU_R0603  [R0603]
SSR_R16  R-EU_R0603  [R0603]
SSR_R17  R-EU_R0603  [R0603]
SSR_R18  R-EU_R0603  [R0603]
SSR_R19  R-EU_R0603  [R0603]
SSR_R20  R-EU_R0603  [R0603]
SSR_R21  R-EU_R0603  [R0603]
SSR_R22  R-EU_R0603  [R0603]
SSR_R23  R-EU_R0603  [R0603]
SSR_R24  R-EU_R0603  [R0603]
SSR_R25  R-EU_R0603  [R0603]
SSR_R26  R-EU_R0603  [R0603]
SSR_R27  R-EU_R0603  [R0603]
SSR_R28  R-EU_R0603  [R0603]
SSR_R29  R-EU_R0603  [R0603]
SSR_R30  R-EU_R0603  [R0603]
SSR_R31  R-EU_R0603  [R0603]
SSR_R32  R-EU_R0603  [R0603]
SSR_R33  R-EU_R0603  [R0603]
SSR_R34  R-EU_R0603  [R0603]
SSR_R35  R-EU_R0603  [R0603]
SSR_R36  R-EU_R0603  [R0603]
SSR_R37  R-EU_R0603  [R0603]
SSR_R38  R-EU_R0603  [R0603]
SSR_R39  R-EU_R0603  [R0603]
SSR_R40  R-EU_R0603  [R0603]
SSR_R41  R-EU_R0603  [R0603]
SSR_R42  R-EU_R0603  [R0603]
SSR_R43  R-EU_R0603  [R0603]
SSR_R44  R-EU_R0603  [R0603]
SSR_R45  R-EU_R0603  [R0603]
SSR_R46  R-EU_R0603  [R0603]
SSR_R47  R-EU_R0603  [R0603]
SSR_R48  R-EU_R0603  [R0603]
SSR_R49  R-EU_R0603  [R0603]
SSR_R50  R-EU_R0603  [R0603]
SSR_R51  R-EU_R0603  [R0603]
SSR_R52  R-EU_R0603  [R0603]
SSR_R53  R-EU_R0603  [R0603]
SSR_R54  R-EU_R0603  [R0603]
SSR_R55  R-EU_R0603  [R0603]
SSR_R56  R-EU_R0603  [R0603]
SSR_R57  R-EU_R0603  [R0603]
SSR_R58  R-EU_R0603  [R0603]
SSR_R59  R-EU_R0603  [R0603]
SSR_R60  R-EU_R0603  [R0603]
SSR_R61  R-EU_R0603  [R0603]
SSR_R62  R-EU_R0603  [R0603]
SSR_R63  R-EU_R0603  [R0603]
SSR_R64  R-EU_R0603  [R0603]
SSR_R65  R-EU_R0603  [R0603]
SSR_R66  R-EU_R0603  [R0603]
SSR_R67  R-EU_R0603  [R0603]
SSR_R68  R-EU_R0603  [R0603]
SSR_R69  R-EU_R0603  [R0603]
SSR_R70  R-EU_R0603  [R0603]
SSR_R71  R-EU_R0603  [R0603]
SSR_R72  R-EU_R0603  [R0603]
SSR_R73  R-EU_R0603  [R0603]
SSR_R74  R-EU_R0603  [R0603]
SSR_R75  R-EU_R0603  [R0603]
SSR_R76  R-EU_R0603  [R0603]
SSR_R77  R-EU_R0603  [R0603]
SSR_R78  R-EU_R0603  [R0603]
SSR_R79  R-EU_R0603  [R0603]
SSR_R80  R-EU_R0603  [R0603]
SSR_R81  R-EU_R0603  [R0603]
SSR_R82  R-EU_R0603  [R0603]
SSR_R83  R-EU_R0603  [R0603]
SSR_R84  R-EU_R0603  [R0603]
SSR_R85  R-EU_R0603  [R0603]
SSR_R86  R-EU_R0603  [R0603]
SSR_R87  R-EU_R0603  [R0603]
SSR_R88  R-EU_R0603  [R0603]
SSR_R89  R-EU_R0603  [R0603]
SSR_R90  R-EU_R0603  [R0603]
SSR_R91  R-EU_R0603  [R0603]
SSR_R92  R-EU_R0603  [R0603]
SSR_R93  R-EU_R0603  [R0603]
SSR_R94  R-EU_R0603  [R0603]
SSR_R95  R-EU_R0603  [R0603]
SSR_R96  R-EU_R0603  [R0603]
SSR_R97  R-EU_R0603  [R0603]
SSR_R98  R-EU_R0603  [R0603]
SSR_R99  R-EU_R0603  [R0603]
SSR_R100  R-EU_R0603  [R0603]
SSR_R101  R-EU_R0603  [R0603]
SSR_R102  R-EU_R0603  [R0603]
SSR_R103  R-EU_R0603  [R0603]
SSR_R104  R-EU_R0603  [R0603]
SSR_R105  R-EU_R0603  [R0603]
SSR_R106  R-EU_R0603  [R0603]
SSR_R107  R-EU_R0603  [R0603]
SSR_R108  R-EU_R0603  [R0603]
SSR_R109  R-EU_R0603  [R0603]
SSR_R110  R-EU_R0603  [R0603]
SSR_R111  R-EU_R0603  [R0603]
SSR_R112  R-EU_R0603  [R0603]
SSR_R113  R-EU_R0603  [R0603]
SSR_R114  R-EU_R0603  [R0603]
SSR_R115  R-EU_R0603  [R0603]
SSR_R116  R-EU_R0603  [R0603]
SSR_R117  R-EU_R0603  [R0603]
SSR_R118  R-EU_R0603  [R0603]
SSR_R119  R-EU_R0603  [R0603]
SSR_R120  R-EU_R0603  [R0603]
SSR_R121  R-EU_R0603  [R0603]
SSR_R122  R-EU_R0603  [R0603]
SSR_R123  R-EU_R0603  [R0603]
SSR_R124  R-EU_R0603  [R0603]
SSR_R125  R-EU_R0603  [R0603]
SSR_R126  R-EU_R0603  [R0603]
SSR_R127  R-EU_R0603  [R0603]
SSR_R128  R-EU_R0603  [R0603]
SSR_R129  R-EU_R0603  [R0603]
SSR_R130  R-EU_R0603  [R0603]
SSR_R131  R-EU_R0603  [R0603]
SSR_R132  R-EU_R0603  [R0603]
SSR_R133  R-EU_R0603  [R0603]
SSR_R134  R-EU_R0603  [R0603]
SSR_R135  R-EU_R0603  [R0603]
SSR_R136  R-EU_R0603  [R0603]
SSR_R137  R-EU_R0603  [R0603]
SSR_R138  R-EU_R0603  [R0603]
SSR_R139  R-EU_R0603  [R0603]
SSR_R140  R-EU_R0603  [R0603]
SSR_R141  R-EU_R0603  [R0603]
SSR_R142  R-EU_R0603  [R0603]
SSR_R143  R-EU_R0603  [R0603]
SSR_R144  R-EU_R0603  [R0603]
SSR_R145  R-EU_R0603  [R0603]
SSR_R146  R-EU_R0603  [R0603]
SSR_R147  R-EU_R0603  [R0603]
SSR_R148  R-EU_R0603  [R0603]
SSR_R149  R-EU_R0603  [R0603]
SSR_R150  R-EU_R0603  [R0603]
SSR_R151  R-EU_R0603  [R0603]
SSR_R152  R-EU_R0603  [R0603]
SSR_R153  R-EU_R0603  [R0603]
SSR_R154  R-EU_R0603  [R0603]
SSR_R155  R-EU_R0603  [R0603]
SSR_R156  R-EU_R0603  [R0603]
SSR_R157  R-EU_R0603  [R0603]
SSR_R158  R-EU_R0603  [R0603]
SSR_R159  R-EU_R0603  [R0603]
SSR_R160  R-EU_R0603  [R0603]
SSR_R161  R-EU_R0603  [R0603]
SSR_R162  R-EU_R0603  [R0603]
SSR_R163  R-EU_R0603  [R0603]
SSR_R164  R-EU_R0603  [R0603]
SSR_R165  R-EU_R0603  [R0603]
SSR_R166  R-EU_R0603  [R0603]
SSR_R167  R-EU_R0603  [R0603]
SSR_R168  R-EU_R0603  [R0603]
SSR_R169  R-EU_R0603  [R0603]
SSR_R170  R-EU_R0603  [R0603]
SSR_R171  R-EU_R0603  [R0603]
SSR_R172  R-EU_R0603  [R0603]
SSR_R173  R-EU_R0603  [R0603]
SSR_R174  R-EU_R0603  [R0603]
SSR_R175  R-EU_R0603  [R0603]
SSR_R176  R-EU_R0603  [R0603]
SSR_R177  R-EU_R0603  [R0603]
SSR_R178  R-EU_R0603  [R0603]
SSR_R179  R-EU_R0603  [R0603]
SSR_R180  R-EU_R0603  [R0603]
SSR_R181  R-EU_R0603  [R0603]
SSR_R182  R-EU_R0603  [R0603]
SSR_R183  R-EU_R0603  [R0603]
SSR_R184  R-EU_R0603  [R0603]
SSR_R185  R-EU_R0603  [R0603]
SSR_R186  R-EU_R0603  [R0603]
SSR_R187  R-EU_R0603  [R0603]
SSR_R188  R-EU_R0603  [R0603]
SSR_R189  R-EU_R0603  [R0603]
SSR_R190  R-EU_R0603  [R0603]
SSR_R191  R-EU_R0603  [R0603]
SSR_R192  R-EU_R0603  [R0603]
SSR_R193  R-EU_R0603  [R0603]
SSR_R194  R-EU_R0603  [R0603]
SSR_R195  R-EU_R0603  [R0603]
SSR_R196  R-EU_R0603  [R0603]
SSR_R197  R-EU_R0603  [R0603]
SSR_R198  R-EU_R0603  [R0603]
SSR_R199  R-EU_R0603  [R0603]
SSR_R200  R-EU_R0603  [R0603]
T1  MMBT2222ALT1-NPN-SOT23-BEC  [SOT23-BEC]
T2  MMBT2222ALT1-NPN-SOT23-BEC  [SOT23-BEC]
T3  MMBT2222ALT1-NPN-SOT23-BEC  [SOT23-BEC]
T9  MMBT2222ALT1-NPN-SOT23-BEC  [SOT23-BEC]
TP_V_SENSING  PTR1PAD1-13  [P1-13]
U1  DS1307  [DIL08]
U2  RHT03_DHT-22_AM2302  [RHT03_DHT-22]
U$1  ARDUINO_R3_SHIELD  [UNO_R3_SHIELD]
U$2  DCDCMODULE  [DCDCMODULE]
U$4  ESP8266  [ESP8266]
U$5  SIMHOLDER3  [SIMHOLDER3]
X1  SMACONNECTOR  [SMA90_DIP]

## Nets
3V3: L1.1 R10.2
+3V3: C7-100U.+ C8-100U.+ IC15.P$55(VBAT1) IC15.P$56(VBAT2) IC15.P$57(VBAT3) R20-1K.2 R26-1K.2 U$2.VOUT U$4.CHPD U$4.VCC
AGND [gnd]: C10.2 CUR_SENS_JACK.TIP(LEFT) R9.1
CE: IC1.15(INH) IC2.15(INH) IC3.15(INH) IC4.15(INH) IC5.15(INH) IC6.15(INH) IC7.15(INH) IC8.15(INH) IC9.15(INH) IC10.15(INH) IC11.15(INH) IC12.15(INH) IC13.15(INH) U$1.D8
CLK: IC1.2(CLK) IC2.2(CLK) IC3.2(CLK) IC4.2(CLK) IC5.2(CLK) IC6.2(CLK) IC7.2(CLK) IC8.2(CLK) IC9.2(CLK) IC10.2(CLK) IC11.2(CLK) IC12.2(CLK) IC13.2(CLK) U$1.D7
DBG_RX: JP400.2 U$1.A2
DBG_TX: JP400.1 U$1.A3
DHT_DATA: RDHT-10K.1 U2.DATA U$1.D5(*D5)
ESP_RX: R3-1K.1 R4-2K.2 U$4.RXD
ESP_TX: U$1.D3(*D3) U$4.TXD
GND: BAT1.2(-) C1.2 C3.2 C7-100U.- C8-100U.- C9-100N.2 C10-4U7.1 C11-22P.2 CSIM_22P.1 CSIM_100N.1 D15.2(A) IC1.8(GND) IC2.8(GND) IC3.8(GND) IC4.8(GND) IC5.8(GND) IC6.8(GND) IC7.8(GND) IC8.8(GND) IC9.8(GND) IC10.8(GND) IC11.8(GND) IC12.8(GND) IC13.8(GND) IC14.8(GND) IC15.P$18(GND) IC16.8(GND) IC17.8(GND) IC18.8(GND) IC19.8(GND) IC20.8(GND) IC21.8(GND) IC22.8(GND) IC23.8(GND) IC24.8(GND) IC25.8(GND) IC26.8(GND) IC27.8(GND) JP1.10 JP2.10 JP3.10 JP4.10 JP5.10 JP6.10 JP7.10 JP8.10 JP9.10 JP10.10 JP11.10 JP12.10 JP13.10 JP100.3 JP100.4 K1.4 K2.4 K3.4 K4.4 K5.4 K6.4 K7.4 K8.4 K9.4 K10.4 K11.4 K12.4 K13.4 K14.4 K15.4 K16.4 K17.4 K18.4 K19.4 K20.4 K21.4 K22.4 K23.4 K24.4 K25.4 K26.4 K27.4 K28.4 K29.4 K30.4 K31.4 K32.4 K33.4 K34.4 K35.4 K36.4 K37.4 K38.4 K39.4 K40.4 K41.4 K42.4 K43.4 K44.4 K45.4 K46.4 K47.4 K48.4 K49.4 K50.4 K51.4 K52.4 K53.4 K54.4 K55.4 K56.4 K57.4 K58.4 K59.4 K60.4 K61.4 K62.4 K63.4 K64.4 K65.4 K66.4 K67.4 K68.4 K69.4 K70.4 K71.4 K72.4 K73.4 K74.4 K75.4 K76.4 K77.4 K78.4 K79.4 K80.4 K81.4 K82.4 K83.4 K84.4 K85.4 K86.4 K87.4 K88.4 K89.4 K90.4 K91.4 K92.4 K93.4 K94.4 K95.4 K96.4 K97.4 K98.4 K99.4 K100.4 L3.2 R4-2K.1 R5-2K.1 R5-100K.1 R25-10K.2 R28-10K.2 S1.3(P) S1.4(P1) SMPS_OUT.2 SSR_C1.1 SSR_C3.1 SSR_C5.1 SSR_C7.1 SSR_C9.1 SSR_C11.1 SSR_C13.1 SSR_C15.1 SSR_C17.1 SSR_C19.1 SSR_C21.1 SSR_C23.1 SSR_C25.1 SSR_C27.1 SSR_C29.1 SSR_C31.1 SSR_C33.1 SSR_C35.1 SSR_C37.1 SSR_C39.1 SSR_C41.1 SSR_C43.1 SSR_C45.1 SSR_C47.1 SSR_C49.1 SSR_C51.1 SSR_C53.1 SSR_C55.1 SSR_C57.1 SSR_C59.1 SSR_C61.1 SSR_C63.1 SSR_C65.1 SSR_C67.1 SSR_C69.1 SSR_C71.1 SSR_C73.1 SSR_C75.1 SSR_C77.1 SSR_C79.1 SSR_C81.1 SSR_C83.1 SSR_C85.1 SSR_C87.1 SSR_C89.1 SSR_C91.1 SSR_C93.1 SSR_C95.1 SSR_C97.1 SSR_C99.1 SSR_C101.1 SSR_C103.1 SSR_C105.1 SSR_C107.1 SSR_C109.1 SSR_C111.1 SSR_C113.1 SSR_C115.1 SSR_C117.1 SSR_C119.1 SSR_C121.1 SSR_C123.1 SSR_C125.1 SSR_C127.1 SSR_C129.1 SSR_C131.1 SSR_C133.1 SSR_C135.1 SSR_C137.1 SSR_C139.1 SSR_C141.1 SSR_C143.1 SSR_C145.1 SSR_C147.1 SSR_C149.1 SSR_C151.1 SSR_C153.1 SSR_C155.1 SSR_C157.1 SSR_C159.1 SSR_C161.1 SSR_C163.1 SSR_C165.1 SSR_C167.1 SSR_C169.1 SSR_C171.1 SSR_C173.1 SSR_C175.1 SSR_C177.1 SSR_C179.1 SSR_C181.1 SSR_C183.1 SSR_C185.1 SSR_C187.1 SSR_C189.1 SSR_C191.1 SSR_C193.1 SSR_C195.1 SSR_C197.1 SSR_C199.1 SSR_D1.A SSR_D2.A SSR_D3.A SSR_D4.A SSR_D5.A SSR_D6.A SSR_D7.A SSR_D8.A SSR_D9.A SSR_D10.A SSR_D11.A SSR_D12.A SSR_D13.A SSR_D14.A SSR_D15.A SSR_D16.A SSR_D17.A SSR_D18.A SSR_D19.A SSR_D20.A SSR_D21.A SSR_D22.A SSR_D23.A SSR_D24.A SSR_D25.A SSR_D26.A SSR_D27.A SSR_D28.A SSR_D29.A SSR_D30.A SSR_D31.A SSR_D32.A SSR_D33.A SSR_D34.A SSR_D35.A SSR_D36.A SSR_D37.A SSR_D38.A SSR_D39.A SSR_D40.A SSR_D41.A SSR_D42.A SSR_D43.A SSR_D44.A SSR_D45.A SSR_D46.A SSR_D47.A SSR_D48.A SSR_D49.A SSR_D50.A SSR_D51.A SSR_D52.A SSR_D53.A SSR_D54.A SSR_D55.A SSR_D56.A SSR_D57.A SSR_D58.A SSR_D59.A SSR_D60.A SSR_D61.A SSR_D62.A SSR_D63.A SSR_D64.A SSR_D65.A SSR_D66.A SSR_D67.A SSR_D68.A SSR_D69.A SSR_D70.A SSR_D71.A SSR_D72.A SSR_D73.A SSR_D74.A SSR_D75.A SSR_D76.A SSR_D77.A SSR_D78.A SSR_D79.A SSR_D80.A SSR_D81.A SSR_D82.A SSR_D83.A SSR_D84.A SSR_D85.A SSR_D86.A SSR_D87.A SSR_D88.A SSR_D89.A SSR_D90.A SSR_D91.A SSR_D92.A SSR_D93.A SSR_D94.A SSR_D95.A SSR_D96.A SSR_D97.A SSR_D98.A SSR_D99.A SSR_D100.A T1.E T2.E T3.E T9.E U1.4(GND) U2.GND U$1.GND@0(GND) U$1.GND@1(GND) U$2.GND#0(GNDI) U$2.GND#1(GNDO) U$4.GND U$5.6(GND) X1.GND1 X1.GND2 X1.GND3 X1.GND4 ; supply symbol labelled DGND
I_SENSING: R8.2 U$1.A0
LOAD_1: K1.1 SSR_R2.1
LOAD_2: K2.1 SSR_R4.1
LOAD_3: K3.1 SSR_R6.1
LOAD_4: K4.1 SSR_R8.1
LOAD_5: K5.1 SSR_R10.1
LOAD_6: K6.1 SSR_R12.1
LOAD_7: K7.1 SSR_R14.1
LOAD_8: K8.1 SSR_R16.1
LOAD_9: K9.1 SSR_R18.1
LOAD_10: K10.1 SSR_R20.1
LOAD_11: K11.1 SSR_R22.1
LOAD_12: K12.1 SSR_R24.1
LOAD_13: K13.1 SSR_R26.1
LOAD_14: K14.1 SSR_R28.1
LOAD_15: K15.1 SSR_R30.1
LOAD_16: K16.1 SSR_R32.1
LOAD_17: K17.1 SSR_R34.1
LOAD_18: K18.1 SSR_R36.1
LOAD_19: K19.1 SSR_R38.1
LOAD_20: K20.1 SSR_R40.1
LOAD_21: K21.1 SSR_R42.1
LOAD_22: K22.1 SSR_R44.1
LOAD_23: K23.1 SSR_R46.1
LOAD_24: K24.1 SSR_R48.1
LOAD_25: K25.1 SSR_R50.1
LOAD_26: K26.1 SSR_R52.1
LOAD_27: K27.1 SSR_R54.1
LOAD_28: K28.1 SSR_R56.1
LOAD_29: K29.1 SSR_R58.1
LOAD_30: K30.1 SSR_R60.1
LOAD_31: K31.1 SSR_R62.1
LOAD_32: K32.1 SSR_R64.1
LOAD_33: K33.1 SSR_R66.1
LOAD_34: K34.1 SSR_R68.1
LOAD_35: K35.1 SSR_R70.1
LOAD_36: K36.1 SSR_R72.1
LOAD_37: K37.1 SSR_R74.1
LOAD_38: K38.1 SSR_R76.1
LOAD_39: K39.1 SSR_R78.1
LOAD_40: K40.1 SSR_R80.1
LOAD_41: K41.1 SSR_R82.1
LOAD_42: K42.1 SSR_R84.1
LOAD_43: K43.1 SSR_R86.1
LOAD_44: K44.1 SSR_R88.1
LOAD_45: K45.1 SSR_R90.1
LOAD_46: K46.1 SSR_R92.1
LOAD_47: K47.1 SSR_R94.1
LOAD_48: K48.1 SSR_R96.1
LOAD_49: K49.1 SSR_R98.1
LOAD_50: K50.1 SSR_R100.1
LOAD_51: K51.1 SSR_R102.1
LOAD_52: K52.1 SSR_R104.1
LOAD_53: K53.1 SSR_R106.1
LOAD_54: K54.1 SSR_R108.1
LOAD_55: K55.1 SSR_R110.1
LOAD_56: K56.1 SSR_R112.1
LOAD_57: K57.1 SSR_R114.1
LOAD_58: K58.1 SSR_R116.1
LOAD_59: K59.1 SSR_R118.1
LOAD_60: K60.1 SSR_R120.1
LOAD_61: K61.1 SSR_R122.1
LOAD_62: K62.1 SSR_R124.1
LOAD_63: K63.1 SSR_R126.1
LOAD_64: K64.1 SSR_R128.1
LOAD_65: K65.1 SSR_R130.1
LOAD_66: K66.1 SSR_R132.1
LOAD_67: K67.1 SSR_R134.1
LOAD_68: K68.1 SSR_R136.1
LOAD_69: K69.1 SSR_R138.1
LOAD_70: K70.1 SSR_R140.1
LOAD_71: K71.1 SSR_R142.1
LOAD_72: K72.1 SSR_R144.1
LOAD_73: K73.1 SSR_R146.1
LOAD_74: K74.1 SSR_R148.1
LOAD_75: K75.1 SSR_R150.1
LOAD_76: K76.1 SSR_R152.1
LOAD_77: K77.1 SSR_R154.1
LOAD_78: K78.1 SSR_R156.1
LOAD_79: K79.1 SSR_R158.1
LOAD_80: K80.1 SSR_R160.1
LOAD_81: K81.1 SSR_R162.1
LOAD_82: K82.1 SSR_R164.1
LOAD_83: K83.1 SSR_R166.1
LOAD_84: K84.1 SSR_R168.1
LOAD_85: K85.1 SSR_R170.1
LOAD_86: K86.1 SSR_R172.1
LOAD_87: K87.1 SSR_R174.1
LOAD_88: K88.1 SSR_R176.1
LOAD_89: K89.1 SSR_R178.1
LOAD_90: K90.1 SSR_R180.1
LOAD_91: K91.1 SSR_R182.1
LOAD_92: K92.1 SSR_R184.1
LOAD_93: K93.1 SSR_R186.1
LOAD_94: K94.1 SSR_R188.1
LOAD_95: K95.1 SSR_R190.1
LOAD_96: K96.1 SSR_R192.1
LOAD_97: K97.1 SSR_R194.1
LOAD_98: K98.1 SSR_R196.1
LOAD_99: K99.1 SSR_R198.1
LOAD_100: K100.1 SSR_R200.1
N$1: C3.1 L1.2 R4-100K.1
N$2: IC15.P$32(SIM_CLK) R10-22.1
N$3: IC15.P$31(SIM_DATA) R11-22.1
N$4: IC15.P$33(SIM_RST) R9-22.1
N$5: C10-4U7.2 IC15.P$26(VRTC)
N$6: IC15.P$60(RF_ANT) X1.ANTENNA(ANT)
N$7: R1-1K.2 U$1.TX
N$8: LED1.A R20-1K.1
N$9: LED1.K(C) T1.C
N$10: R23-1K.1 R25-10K.1 T1.B
N$11: LED2.A R26-1K.1
N$12: LED2.K(C) T2.C
N$13: R27-1K.1 R28-10K.1 T2.B
N$14: R30.2 T9.B
N$15: R2.2 T3.B
N$16: Q1.1 U1.2(X2)
N$17: R3-1K.2 U$1.D4
N$19: Q1.2 U1.1(X1)
N$20: C1.1 R4-100K.2 R5-100K.2 R23.1
N$21: R23.2 R24.1 R25.1
N$22: L4.2 R24.2
N$23: BAT1.1(+) U1.3(VBAT)
N$24: K1.2 K2.2 K3.2 K4.2 K5.2 K6.2 K7.2 K8.2 K9.2 K10.2 K11.2 K12.2 K13.2 K14.2 K15.2 K16.2 K17.2 K18.2 K19.2 K20.2 K21.2 K22.2 K23.2 K24.2 K25.2 K26.2 K27.2 K28.2 K29.2 K30.2 K31.2 K32.2 K33.2 K34.2 K35.2 K36.2 K37.2 K38.2 K39.2 K40.2 K41.2 K42.2 K43.2 K44.2 K45.2 K46.2 K47.2 K48.2 K49.2 K50.2 K51.2 K52.2 K53.2 K54.2 K55.2 K56.2 K57.2 K58.2 K59.2 K60.2 K61.2 K62.2 K63.2 K64.2 K65.2 K66.2 K67.2 K68.2 K69.2 K70.2 K71.2 K72.2 K73.2 K74.2 K75.2 K76.2 K77.2 K78.2 K79.2 K80.2 K81.2 K82.2 K83.2 K84.2 K85.2 K86.2 K87.2 K88.2 K89.2 K90.2 K91.2 K92.2 K93.2 K94.2 K95.2 K96.2 K97.2 K98.2 K99.2 K100.2 SSR_C2.2 SSR_C4.2 SSR_C6.2 SSR_C8.2 SSR_C10.2 SSR_C12.2 SSR_C14.2 SSR_C16.2 SSR_C18.2 SSR_C20.2 SSR_C22.2 SSR_C24.2 SSR_C26.2 SSR_C28.2 SSR_C30.2 SSR_C32.2 SSR_C34.2 SSR_C36.2 SSR_C38.2 SSR_C40.2 SSR_C42.2 SSR_C44.2 SSR_C46.2 SSR_C48.2 SSR_C50.2 SSR_C52.2 SSR_C54.2 SSR_C56.2 SSR_C58.2 SSR_C60.2 SSR_C62.2 SSR_C64.2 SSR_C66.2 SSR_C68.2 SSR_C70.2 SSR_C72.2 SSR_C74.2 SSR_C76.2 SSR_C78.2 SSR_C80.2 SSR_C82.2 SSR_C84.2 SSR_C86.2 SSR_C88.2 SSR_C90.2 SSR_C92.2 SSR_C94.2 SSR_C96.2 SSR_C98.2 SSR_C100.2 SSR_C102.2 SSR_C104.2 SSR_C106.2 SSR_C108.2 SSR_C110.2 SSR_C112.2 SSR_C114.2 SSR_C116.2 SSR_C118.2 SSR_C120.2 SSR_C122.2 SSR_C124.2 SSR_C126.2 SSR_C128.2 SSR_C130.2 SSR_C132.2 SSR_C134.2 SSR_C136.2 SSR_C138.2 SSR_C140.2 SSR_C142.2 SSR_C144.2 SSR_C146.2 SSR_C148.2 SSR_C150.2 SSR_C152.2 SSR_C154.2 SSR_C156.2 SSR_C158.2 SSR_C160.2 SSR_C162.2 SSR_C164.2 SSR_C166.2 SSR_C168.2 SSR_C170.2 SSR_C172.2 SSR_C174.2 SSR_C176.2 SSR_C178.2 SSR_C180.2 SSR_C182.2 SSR_C184.2 SSR_C186.2 SSR_C188.2 SSR_C190.2 SSR_C192.2 SSR_C194.2 SSR_C196.2 SSR_C198.2 SSR_C200.2
N$25: CUR_SENS_JACK.SLEEVE R1.2 R3.1 R8.1
N$26: C10.1 CUR_SENS_JACK.RING(RIGHT) R1.1 R3.2 R9.2 R10.1
N$29: SSR_C2.1 SSR_R2.2
N$32: U2.NULL
N$33: K2.3 SSR_C3.2 SSR_D2.C SSR_R3.2
N$34: SSR_C4.1 SSR_R4.2
N$35: K1.3 SSR_C1.2 SSR_D1.C SSR_R1.2
N$36: K3.3 SSR_C5.2 SSR_D3.C SSR_R5.2
N$37: SSR_C6.1 SSR_R6.2
N$38: K4.3 SSR_C7.2 SSR_D4.C SSR_R7.2
N$39: SSR_C8.1 SSR_R8.2
N$40: K5.3 SSR_C9.2 SSR_D5.C SSR_R9.2
N$41: SSR_C10.1 SSR_R10.2
N$42: K6.3 SSR_C11.2 SSR_D6.C SSR_R11.2
N$43: SSR_C12.1 SSR_R12.2
N$44: K7.3 SSR_C13.2 SSR_D7.C SSR_R13.2
N$45: SSR_C14.1 SSR_R14.2
N$46: K8.3 SSR_C15.2 SSR_D8.C SSR_R15.2
N$47: SSR_C16.1 SSR_R16.2
N$48: K9.3 SSR_C17.2 SSR_D9.C SSR_R17.2
N$49: SSR_C18.1 SSR_R18.2
N$50: K10.3 SSR_C19.2 SSR_D10.C SSR_R19.2
N$51: SSR_C20.1 SSR_R20.2
N$52: K11.3 SSR_C21.2 SSR_D11.C SSR_R21.2
N$53: SSR_C22.1 SSR_R22.2
N$54: K12.3 SSR_C23.2 SSR_D12.C SSR_R23.2
N$55: SSR_C24.1 SSR_R24.2
N$56: K13.3 SSR_C25.2 SSR_D13.C SSR_R25.2
N$57: SSR_C26.1 SSR_R26.2
N$58: K14.3 SSR_C27.2 SSR_D14.C SSR_R27.2
N$59: SSR_C28.1 SSR_R28.2
N$60: K15.3 SSR_C29.2 SSR_D15.C SSR_R29.2
N$61: SSR_C30.1 SSR_R30.2
N$62: K16.3 SSR_C31.2 SSR_D16.C SSR_R31.2
N$63: SSR_C32.1 SSR_R32.2
N$64: K17.3 SSR_C33.2 SSR_D17.C SSR_R33.2
N$65: SSR_C34.1 SSR_R34.2
N$66: K18.3 SSR_C35.2 SSR_D18.C SSR_R35.2
N$67: SSR_C36.1 SSR_R36.2
N$68: K19.3 SSR_C37.2 SSR_D19.C SSR_R37.2
N$69: SSR_C38.1 SSR_R38.2
N$70: K20.3 SSR_C39.2 SSR_D20.C SSR_R39.2
N$71: SSR_C40.1 SSR_R40.2
N$72: K21.3 SSR_C41.2 SSR_D21.C SSR_R41.2
N$73: SSR_C42.1 SSR_R42.2
N$74: K22.3 SSR_C43.2 SSR_D22.C SSR_R43.2
N$75: SSR_C44.1 SSR_R44.2
N$76: K23.3 SSR_C45.2 SSR_D23.C SSR_R45.2
N$77: SSR_C46.1 SSR_R46.2
N$78: K24.3 SSR_C47.2 SSR_D24.C SSR_R47.2
N$79: SSR_C48.1 SSR_R48.2
N$80: K25.3 SSR_C49.2 SSR_D25.C SSR_R49.2
N$81: SSR_C50.1 SSR_R50.2
N$82: K26.3 SSR_C51.2 SSR_D26.C SSR_R51.2
N$83: SSR_C52.1 SSR_R52.2
N$84: K27.3 SSR_C53.2 SSR_D27.C SSR_R53.2
N$85: SSR_C54.1 SSR_R54.2
N$86: K28.3 SSR_C55.2 SSR_D28.C SSR_R55.2
N$87: SSR_C56.1 SSR_R56.2
N$88: K29.3 SSR_C57.2 SSR_D29.C SSR_R57.2
N$89: SSR_C58.1 SSR_R58.2
N$90: K30.3 SSR_C59.2 SSR_D30.C SSR_R59.2
N$91: SSR_C60.1 SSR_R60.2
N$92: K31.3 SSR_C61.2 SSR_D31.C SSR_R61.2
N$93: SSR_C62.1 SSR_R62.2
N$94: K32.3 SSR_C63.2 SSR_D32.C SSR_R63.2
N$95: SSR_C64.1 SSR_R64.2
N$96: K33.3 SSR_C65.2 SSR_D33.C SSR_R65.2
N$97: SSR_C66.1 SSR_R66.2
N$98: K34.3 SSR_C67.2 SSR_D34.C SSR_R67.2
N$99: SSR_C68.1 SSR_R68.2
N$100: K35.3 SSR_C69.2 SSR_D35.C SSR_R69.2
N$101: SSR_C70.1 SSR_R70.2
N$102: K36.3 SSR_C71.2 SSR_D36.C SSR_R71.2
N$103: SSR_C72.1 SSR_R72.2
N$104: K37.3 SSR_C73.2 SSR_D37.C SSR_R73.2
N$105: SSR_C74.1 SSR_R74.2
N$106: K38.3 SSR_C75.2 SSR_D38.C SSR_R75.2
N$107: SSR_C76.1 SSR_R76.2
N$108: K39.3 SSR_C77.2 SSR_D39.C SSR_R77.2
N$109: SSR_C78.1 SSR_R78.2
N$110: K40.3 SSR_C79.2 SSR_D40.C SSR_R79.2
N$111: SSR_C80.1 SSR_R80.2
N$112: K41.3 SSR_C81.2 SSR_D41.C SSR_R81.2
N$113: SSR_C82.1 SSR_R82.2
N$114: K42.3 SSR_C83.2 SSR_D42.C SSR_R83.2
N$115: SSR_C84.1 SSR_R84.2
N$116: K43.3 SSR_C85.2 SSR_D43.C SSR_R85.2
N$117: SSR_C86.1 SSR_R86.2
N$118: K44.3 SSR_C87.2 SSR_D44.C SSR_R87.2
N$119: SSR_C88.1 SSR_R88.2
N$120: K45.3 SSR_C89.2 SSR_D45.C SSR_R89.2
N$121: SSR_C90.1 SSR_R90.2
N$122: K46.3 SSR_C91.2 SSR_D46.C SSR_R91.2
N$123: SSR_C92.1 SSR_R92.2
N$124: K47.3 SSR_C93.2 SSR_D47.C SSR_R93.2
N$125: SSR_C94.1 SSR_R94.2
N$126: K48.3 SSR_C95.2 SSR_D48.C SSR_R95.2
N$127: SSR_C96.1 SSR_R96.2
N$128: K49.3 SSR_C97.2 SSR_D49.C SSR_R97.2
N$129: SSR_C98.1 SSR_R98.2
N$130: K50.3 SSR_C99.2 SSR_D50.C SSR_R99.2
N$131: SSR_C100.1 SSR_R100.2
N$132: K51.3 SSR_C101.2 SSR_D51.C SSR_R101.2
N$133: SSR_C102.1 SSR_R102.2
N$134: K52.3 SSR_C103.2 SSR_D52.C SSR_R103.2
N$135: SSR_C104.1 SSR_R104.2
N$136: K53.3 SSR_C105.2 SSR_D53.C SSR_R105.2
N$137: SSR_C106.1 SSR_R106.2
N$138: K54.3 SSR_C107.2 SSR_D54.C SSR_R107.2
N$139: SSR_C108.1 SSR_R108.2
N$140: K55.3 SSR_C109.2 SSR_D55.C SSR_R109.2
N$141: SSR_C110.1 SSR_R110.2
N$142: K56.3 SSR_C111.2 SSR_D56.C SSR_R111.2
N$143: SSR_C112.1 SSR_R112.2
N$144: K57.3 SSR_C113.2 SSR_D57.C SSR_R113.2
N$145: SSR_C114.1 SSR_R114.2
N$146: K58.3 SSR_C115.2 SSR_D58.C SSR_R115.2
N$147: SSR_C116.1 SSR_R116.2
N$148: K59.3 SSR_C117.2 SSR_D59.C SSR_R117.2
N$149: SSR_C118.1 SSR_R118.2
N$150: K60.3 SSR_C119.2 SSR_D60.C SSR_R119.2
N$151: SSR_C120.1 SSR_R120.2
N$152: K61.3 SSR_C121.2 SSR_D61.C SSR_R121.2
N$153: SSR_C122.1 SSR_R122.2
N$154: K62.3 SSR_C123.2 SSR_D62.C SSR_R123.2
N$155: SSR_C124.1 SSR_R124.2
N$156: K63.3 SSR_C125.2 SSR_D63.C SSR_R125.2
N$157: SSR_C126.1 SSR_R126.2
N$158: K64.3 SSR_C127.2 SSR_D64.C SSR_R127.2
N$159: SSR_C128.1 SSR_R128.2
N$160: K65.3 SSR_C129.2 SSR_D65.C SSR_R129.2
N$161: SSR_C130.1 SSR_R130.2
N$162: K66.3 SSR_C131.2 SSR_D66.C SSR_R131.2
N$163: SSR_C132.1 SSR_R132.2
N$164: K67.3 SSR_C133.2 SSR_D67.C SSR_R133.2
N$165: SSR_C134.1 SSR_R134.2
N$166: K68.3 SSR_C135.2 SSR_D68.C SSR_R135.2
N$167: SSR_C136.1 SSR_R136.2
N$168: K69.3 SSR_C137.2 SSR_D69.C SSR_R137.2
N$169: SSR_C138.1 SSR_R138.2
N$170: K70.3 SSR_C139.2 SSR_D70.C SSR_R139.2
N$171: SSR_C140.1 SSR_R140.2
N$172: K71.3 SSR_C141.2 SSR_D71.C SSR_R141.2
N$173: SSR_C142.1 SSR_R142.2
N$174: K72.3 SSR_C143.2 SSR_D72.C SSR_R143.2
N$175: SSR_C144.1 SSR_R144.2
N$176: K73.3 SSR_C145.2 SSR_D73.C SSR_R145.2
N$177: SSR_C146.1 SSR_R146.2
N$178: K74.3 SSR_C147.2 SSR_D74.C SSR_R147.2
N$179: SSR_C148.1 SSR_R148.2
N$180: K75.3 SSR_C149.2 SSR_D75.C SSR_R149.2
N$181: SSR_C150.1 SSR_R150.2
N$182: K76.3 SSR_C151.2 SSR_D76.C SSR_R151.2
N$183: SSR_C152.1 SSR_R152.2
N$184: K77.3 SSR_C153.2 SSR_D77.C SSR_R153.2
N$185: SSR_C154.1 SSR_R154.2
N$186: K78.3 SSR_C155.2 SSR_D78.C SSR_R155.2
N$187: SSR_C156.1 SSR_R156.2
N$188: K79.3 SSR_C157.2 SSR_D79.C SSR_R157.2
N$189: SSR_C158.1 SSR_R158.2
N$190: K80.3 SSR_C159.2 SSR_D80.C SSR_R159.2
N$191: SSR_C160.1 SSR_R160.2
N$192: K81.3 SSR_C161.2 SSR_D81.C SSR_R161.2
N$193: SSR_C162.1 SSR_R162.2
N$194: K82.3 SSR_C163.2 SSR_D82.C SSR_R163.2
N$195: SSR_C164.1 SSR_R164.2
N$196: K83.3 SSR_C165.2 SSR_D83.C SSR_R165.2
N$197: SSR_C166.1 SSR_R166.2
N$198: K84.3 SSR_C167.2 SSR_D84.C SSR_R167.2
N$199: SSR_C168.1 SSR_R168.2
N$200: K85.3 SSR_C169.2 SSR_D85.C SSR_R169.2
N$201: SSR_C170.1 SSR_R170.2
N$202: K86.3 SSR_C171.2 SSR_D86.C SSR_R171.2
N$203: SSR_C172.1 SSR_R172.2
N$204: K87.3 SSR_C173.2 SSR_D87.C SSR_R173.2
N$205: SSR_C174.1 SSR_R174.2
N$206: K88.3 SSR_C175.2 SSR_D88.C SSR_R175.2
N$207: SSR_C176.1 SSR_R176.2
N$208: K89.3 SSR_C177.2 SSR_D89.C SSR_R177.2
N$209: SSR_C178.1 SSR_R178.2
N$210: K90.3 SSR_C179.2 SSR_D90.C SSR_R179.2
N$211: SSR_C180.1 SSR_R180.2
N$212: K91.3 SSR_C181.2 SSR_D91.C SSR_R181.2
N$213: SSR_C182.1 SSR_R182.2
N$214: K92.3 SSR_C183.2 SSR_D92.C SSR_R183.2
N$215: SSR_C184.1 SSR_R184.2
N$216: K93.3 SSR_C185.2 SSR_D93.C SSR_R185.2
N$217: SSR_C186.1 SSR_R186.2
N$218: K94.3 SSR_C187.2 SSR_D94.C SSR_R187.2
N$219: SSR_C188.1 SSR_R188.2
N$220: K95.3 SSR_C189.2 SSR_D95.C SSR_R189.2
N$221: SSR_C190.1 SSR_R190.2
N$222: K96.3 SSR_C191.2 SSR_D96.C SSR_R191.2
N$223: SSR_C192.1 SSR_R192.2
N$224: K97.3 SSR_C193.2 SSR_D97.C SSR_R193.2
N$225: SSR_C194.1 SSR_R194.2
N$226: K98.3 SSR_C195.2 SSR_D98.C SSR_R195.2
N$227: SSR_C196.1 SSR_R196.2
N$228: K99.3 SSR_C197.2 SSR_D99.C SSR_R197.2
N$229: SSR_C198.1 SSR_R198.2
N$230: K100.3 SSR_C199.2 SSR_D100.C SSR_R199.2
N$231: SSR_C200.1 SSR_R200.2
PAR1: IC14.9(QH*) IC16.14(SER)
PAR2: IC16.9(QH*) IC17.14(SER)
PAR3: IC17.9(QH*) IC18.14(SER)
PAR4: IC18.9(QH*) IC19.14(SER)
PAR5: IC19.9(QH*) IC20.14(SER)
PAR6: IC20.9(QH*) IC21.14(SER)
PAR7: IC21.9(QH*) IC22.14(SER)
PAR8: IC22.9(QH*) IC23.14(SER)
PAR9: IC23.9(QH*) IC24.14(SER)
PAR10: IC24.9(QH*) IC25.14(SER)
PAR11: IC25.9(QH*) IC26.14(SER)
PAR12: IC26.9(QH*) IC27.14(SER)
PL: IC1.1(SH/!LD) IC2.1(SH/!LD) IC3.1(SH/!LD) IC4.1(SH/!LD) IC5.1(SH/!LD) IC6.1(SH/!LD) IC7.1(SH/!LD) IC8.1(SH/!LD) IC9.1(SH/!LD) IC10.1(SH/!LD) IC11.1(SH/!LD) IC12.1(SH/!LD) IC13.1(SH/!LD) U$1.D9(*D9)
POUT_1: IC14.15(QA) SSR_R1.1
POUT_2: IC14.1(QB) SSR_R3.1
POUT_3: IC14.2(QC) SSR_R5.1
POUT_4: IC14.3(QD) SSR_R7.1
POUT_5: IC14.4(QE) SSR_R9.1
POUT_6: IC14.5(QF) SSR_R11.1
POUT_7: IC14.6(QG) SSR_R13.1
POUT_8: IC14.7(QH) SSR_R15.1
POUT_9: IC16.15(QA) SSR_R17.1
POUT_10: IC16.1(QB) SSR_R19.1
POUT_11: IC16.2(QC) SSR_R21.1
POUT_12: IC16.3(QD) SSR_R23.1
POUT_13: IC16.4(QE) SSR_R25.1
POUT_14: IC16.5(QF) SSR_R27.1
POUT_15: IC16.6(QG) SSR_R29.1
POUT_16: IC16.7(QH) SSR_R31.1
POUT_17: IC17.15(QA) SSR_R33.1
POUT_18: IC17.1(QB) SSR_R35.1
POUT_19: IC17.2(QC) SSR_R37.1
POUT_20: IC17.3(QD) SSR_R39.1
POUT_21: IC17.4(QE) SSR_R41.1
POUT_22: IC17.5(QF) SSR_R43.1
POUT_23: IC17.6(QG) SSR_R45.1
POUT_24: IC17.7(QH) SSR_R47.1
POUT_25: IC18.15(QA) SSR_R49.1
POUT_26: IC18.1(QB) SSR_R51.1
POUT_27: IC18.2(QC) SSR_R53.1
POUT_28: IC18.3(QD) SSR_R55.1
POUT_29: IC18.4(QE) SSR_R57.1
POUT_30: IC18.5(QF) SSR_R59.1
POUT_31: IC18.6(QG) SSR_R61.1
POUT_32: IC18.7(QH) SSR_R63.1
POUT_33: IC19.15(QA) SSR_R65.1
POUT_34: IC19.1(QB) SSR_R67.1
POUT_35: IC19.2(QC) SSR_R69.1
POUT_36: IC19.3(QD) SSR_R71.1
POUT_37: IC19.4(QE) SSR_R73.1
POUT_38: IC19.5(QF) SSR_R75.1
POUT_39: IC19.6(QG) SSR_R77.1
POUT_40: IC19.7(QH) SSR_R79.1
POUT_41: IC20.15(QA) SSR_R81.1
POUT_42: IC20.1(QB) SSR_R83.1
POUT_43: IC20.2(QC) SSR_R85.1
POUT_44: IC20.3(QD) SSR_R87.1
POUT_45: IC20.4(QE) SSR_R89.1
POUT_46: IC20.5(QF) SSR_R91.1
POUT_47: IC20.6(QG) SSR_R93.1
POUT_48: IC20.7(QH) SSR_R95.1
POUT_49: IC21.15(QA) SSR_R97.1
POUT_50: IC21.1(QB) SSR_R99.1
POUT_51: IC21.2(QC) SSR_R101.1
POUT_52: IC21.3(QD) SSR_R103.1
POUT_53: IC21.4(QE) SSR_R105.1
POUT_54: IC21.5(QF) SSR_R107.1
POUT_55: IC21.6(QG) SSR_R109.1
POUT_56: SSR_R111.1
POUT_56\: IC21.7(QH)
POUT_57: IC22.15(QA) SSR_R113.1
POUT_58: IC22.1(QB) SSR_R115.1
POUT_59: IC22.2(QC) SSR_R117.1
POUT_60: IC22.3(QD) SSR_R119.1
POUT_61: IC22.4(QE) SSR_R121.1
POUT_62: IC22.5(QF) SSR_R123.1
POUT_63: IC22.6(QG) SSR_R125.1
POUT_64: IC22.7(QH) SSR_R127.1
POUT_65: IC23.15(QA) SSR_R129.1
POUT_66: IC23.1(QB) SSR_R131.1
POUT_67: IC23.2(QC) SSR_R133.1
POUT_68: IC23.3(QD) SSR_R135.1
POUT_69: IC23.4(QE) SSR_R137.1
POUT_70: IC23.5(QF) SSR_R139.1
POUT_71: IC23.6(QG) SSR_R141.1
POUT_72: IC23.7(QH) SSR_R143.1
POUT_73: IC24.15(QA) SSR_R145.1
POUT_74: IC24.1(QB) SSR_R147.1
POUT_75: IC24.2(QC) SSR_R149.1
POUT_76: IC24.3(QD) SSR_R151.1
POUT_77: IC24.4(QE) SSR_R153.1
POUT_78: IC24.5(QF) SSR_R155.1
POUT_79: IC24.6(QG) SSR_R157.1
POUT_80: IC24.7(QH) SSR_R159.1
POUT_81: IC25.15(QA) SSR_R161.1
POUT_82: IC25.1(QB) SSR_R163.1
POUT_83: IC25.2(QC) SSR_R165.1
POUT_84: IC25.3(QD) SSR_R167.1
POUT_85: IC25.4(QE) SSR_R169.1
POUT_86: IC25.5(QF) SSR_R171.1
POUT_87: IC25.6(QG) SSR_R173.1
POUT_88: IC25.7(QH) SSR_R175.1
POUT_89: IC26.15(QA) SSR_R177.1
POUT_90: IC26.1(QB) SSR_R179.1
POUT_91: IC26.2(QC) SSR_R181.1
POUT_92: IC26.3(QD) SSR_R183.1
POUT_93: IC26.4(QE) SSR_R185.1
POUT_94: IC26.5(QF) SSR_R187.1
POUT_95: IC26.6(QG) SSR_R189.1
POUT_96: IC26.7(QH) SSR_R191.1
POUT_97: IC27.15(QA) SSR_R193.1
POUT_98: IC27.1(QB) SSR_R195.1
POUT_99: IC27.2(QC) SSR_R197.1
POUT_100: IC27.3(QD) SSR_R199.1
POUT_101: IC27.4(QE)
POUT_102: IC27.5(QF)
POUT_103: IC27.6(QG)
POUT_104: IC27.7(QH)
PWRKEY: R30.1 U$1.D2
Q7: IC1.9(QH) U$1.D6(*D6)
RESET: R2.1
SCL: R2K2_SCL.2 U1.6(SCL) U$1.A5
SDA: R2K2_SDA.2 U1.5(SDA) U$1.A4
SERIAL1: IC12.10(SER) IC13.9(QH)
SERIAL2: IC11.10(SER) IC12.9(QH)
SERIAL3: IC10.10(SER) IC11.9(QH)
SERIAL4: IC9.10(SER) IC10.9(QH)
SERIAL5: IC8.10(SER) IC9.9(QH)
SERIAL6: IC7.10(SER) IC8.9(QH)
SERIAL7: IC6.10(SER) IC7.9(QH)
SERIAL8: IC5.10(SER) IC6.9(QH)
SERIAL9: IC4.10(SER) IC5.9(QH)
SERIAL10: IC3.10(SER) IC4.9(QH)
SERIAL11: IC2.10(SER) IC3.9(QH)
SERIAL12: IC1.10(SER) IC2.9(QH)
SIM_NETLIGHT: IC15.P$52(NETLIGHT) R27-1K.2
SIM_PWRKEY: IC15.P$1(PWRKEY) S1.1(S) S1.2(S1) T9.C
SIM_RESET: IC15.P$16(NRESET) T3.C
SIM_RX: IC15.P$10(RXD) R1-1K.1 R5-2K.2
SIM_STATUS: IC15.P$66(STATUS) R23-1K.2
SIM_TX: IC15.P$9(TXD) U$1.RX
SIPO_DS: IC14.14(SER) U$1.D10(*D10)
SIPO_OE: IC14.13(G) IC16.13(G) IC17.13(G) IC18.13(G) IC19.13(G) IC20.13(G) IC21.13(G) IC22.13(G) IC23.13(G) IC24.13(G) IC25.13(G) IC26.13(G) IC27.13(G) U$1.D12
SIPO_SHCP: IC14.11(SCK) IC16.11(SCK) IC17.11(SCK) IC18.11(SCK) IC19.11(SCK) IC20.11(SCK) IC21.11(SCK) IC22.11(SCK) IC23.11(SCK) IC24.11(SCK) IC25.11(SCK) IC26.11(SCK) IC27.11(SCK) U$1.D11(*D11)
SIPO_STCP: IC14.12(RCK) IC16.12(RCK) IC17.12(RCK) IC18.12(RCK) IC19.12(RCK) IC20.12(RCK) IC21.12(RCK) IC22.12(RCK) IC23.12(RCK) IC24.12(RCK) IC25.12(RCK) IC26.12(RCK) IC27.12(RCK) U$1.D13
SOUT_1: IC13.11(A) JP13.1 RN13.2
SOUT_2: IC13.12(B) JP13.2 RN13.3
SOUT_3: IC13.13(C) JP13.3 RN13.4
SOUT_4: IC13.14(D) JP13.4 RN13.5
SOUT_5: IC13.3(E) JP13.5 RN13.6
SOUT_6: IC13.4(F) JP13.6 RN13.7
SOUT_7: IC13.5(G) JP13.7 RN13.8
SOUT_8: IC13.6(H) JP13.8 RN13.9
SOUT_9: IC12.11(A) JP12.1 RN12.2
SOUT_10: IC12.12(B) JP12.2 RN12.3
SOUT_11: IC12.13(C) JP12.3 RN12.4
SOUT_12: IC12.14(D) JP12.4 RN12.5
SOUT_13: IC12.3(E) JP12.5 RN12.6
SOUT_14: IC12.4(F) JP12.6 RN12.7
SOUT_15: IC12.5(G) JP12.7 RN12.8
SOUT_16: IC12.6(H) JP12.8 RN12.9
SOUT_17: IC11.11(A) JP11.1 RN11.2
SOUT_18: IC11.12(B) JP11.2 RN11.3
SOUT_19: IC11.13(C) JP11.3 RN11.4
SOUT_20: IC11.14(D) JP11.4 RN11.5
SOUT_21: IC11.3(E) JP11.5 RN11.6
SOUT_22: IC11.4(F) JP11.6 RN11.7
SOUT_23: IC11.5(G) JP11.7 RN11.8
SOUT_24: IC11.6(H) JP11.8 RN11.9
SOUT_25: IC10.11(A) JP10.1 RN10.2
SOUT_26: IC10.12(B) JP10.2 RN10.3
SOUT_27: IC10.13(C) JP10.3 RN10.4
SOUT_28: IC10.14(D) JP10.4 RN10.5
SOUT_29: IC10.3(E) JP10.5 RN10.6
SOUT_30: IC10.4(F) JP10.6 RN10.7
SOUT_31: IC10.5(G) JP10.7 RN10.8
SOUT_32: IC10.6(H) JP10.8 RN10.9
SOUT_33: IC9.11(A) JP9.1 RN9.2
SOUT_34: IC9.12(B) JP9.2 RN9.3
SOUT_35: IC9.13(C) JP9.3 RN9.4
SOUT_36: IC9.14(D) JP9.4 RN9.5
SOUT_37: IC9.3(E) JP9.5 RN9.6
SOUT_38: IC9.4(F) JP9.6 RN9.7
SOUT_39: IC9.5(G) JP9.7 RN9.8
SOUT_40: IC9.6(H) JP9.8 RN9.9
SOUT_41: IC8.11(A) JP8.1 RN8.2
SOUT_42: IC8.12(B) JP8.2 RN8.3
SOUT_43: IC8.13(C) JP8.3 RN8.4
SOUT_44: IC8.14(D) JP8.4 RN8.5
SOUT_45: IC8.3(E) JP8.5 RN8.6
SOUT_46: IC8.4(F) JP8.6 RN8.7
SOUT_47: IC8.5(G) JP8.7 RN8.8
SOUT_48: IC8.6(H) JP8.8 RN8.9
SOUT_49: IC7.11(A) JP7.1 RN7.2
SOUT_50: IC7.12(B) JP7.2 RN7.3
SOUT_51: IC7.13(C) JP7.3 RN7.4
SOUT_52: IC7.14(D) JP7.4 RN7.5
SOUT_53: IC7.3(E) JP7.5 RN7.6
SOUT_54: IC7.4(F) JP7.6 RN7.7
SOUT_55: IC7.5(G) JP7.7 RN7.8
SOUT_56: IC7.6(H) JP7.8 RN7.9
SOUT_57: IC6.11(A) JP6.1 RN6.2
SOUT_58: IC6.12(B) JP6.2 RN6.3
SOUT_59: IC6.13(C) JP6.3 RN6.4
SOUT_60: IC6.14(D) JP6.4 RN6.5
SOUT_61: IC6.3(E) JP6.5 RN6.6
SOUT_62: IC6.4(F) JP6.6 RN6.7
SOUT_63: IC6.5(G) JP6.7 RN6.8
SOUT_64: IC6.6(H) JP6.8 RN6.9
SOUT_65: IC5.11(A) JP5.1 RN5.2
SOUT_66: IC5.12(B) JP5.2 RN5.3
SOUT_67: IC5.13(C) JP5.3 RN5.4
SOUT_68: IC5.14(D) JP5.4 RN5.5
SOUT_69: IC5.3(E) JP5.5 RN5.6
SOUT_70: IC5.4(F) JP5.6 RN5.7
SOUT_71: IC5.5(G) JP5.7 RN5.8
SOUT_72: IC5.6(H) JP5.8 RN5.9
SOUT_73: IC4.11(A) JP4.1 RN4.2
SOUT_74: IC4.12(B) JP4.2 RN4.3
SOUT_75: IC4.13(C) JP4.3 RN4.4
SOUT_76: IC4.14(D) JP4.4 RN4.5
SOUT_77: IC4.3(E) JP4.5 RN4.6
SOUT_78: IC4.4(F) JP4.6 RN4.7
SOUT_79: IC4.5(G) JP4.7 RN4.8
SOUT_80: IC4.6(H) JP4.8 RN4.9
SOUT_81: IC3.11(A) JP3.1 RN3.2
SOUT_82: IC3.12(B) JP3.2 RN3.3
SOUT_83: IC3.13(C) JP3.3 RN3.4
SOUT_84: IC3.14(D) JP3.4 RN3.5
SOUT_85: IC3.3(E) JP3.5 RN3.6
SOUT_86: IC3.4(F) JP3.6 RN3.7
SOUT_87: IC3.5(G) JP3.7 RN3.8
SOUT_88: IC3.6(H) JP3.8 RN3.9
SOUT_89: IC2.11(A) JP2.1 RN2.2
SOUT_90: IC2.12(B) JP2.2 RN2.3
SOUT_91: IC2.13(C) JP2.3 RN2.4
SOUT_92: IC2.14(D) JP2.4 RN2.5
SOUT_93: IC2.3(E) JP2.5 RN2.6
SOUT_94: IC2.4(F) JP2.6 RN2.7
SOUT_95: IC2.5(G) JP2.7 RN2.8
SOUT_96: IC2.6(H) JP2.8 RN2.9
SOUT_97: IC1.11(A) JP1.1 RN1.2
SOUT_98: IC1.12(B) JP1.2 RN1.3
SOUT_99: IC1.13(C) JP1.3 RN1.4
SOUT_100: IC1.14(D) JP1.4 RN1.5
SOUT_101: IC1.3(E) JP1.5 RN1.6
SOUT_102: IC1.4(F) JP1.6 RN1.7
SOUT_103: IC1.5(G) JP1.7 RN1.8
SOUT_104: IC1.6(H) JP1.8 RN1.9
USIM_CLK: D15.4(C3) R10-22.2 U$5.3(CLK)
USIM_DATA: D15.1(C1) R11-22.2 U$5.4(I/O)
USIM_RESET: D15.3(C2) R9-22.2 U$5.2(RST)
USIM_VCC: C9-100N.1 C11-22P.1 CSIM_22P.2 CSIM_100N.2 D15.5(C4) IC15.P$30(SIM_VDD) U$5.1(VCC)
V_SENSING: R25.2 TP_V_SENSING.TP U$1.A1
VCC: IC1.16(VCC) IC2.16(VCC) IC3.16(VCC) IC4.16(VCC) IC5.16(VCC) IC6.16(VCC) IC7.16(VCC) IC8.16(VCC) IC9.16(VCC) IC10.16(VCC) IC11.16(VCC) IC12.16(VCC) IC13.16(VCC) IC14.16(VCC) IC16.16(VCC) IC17.16(VCC) IC18.16(VCC) IC19.16(VCC) IC20.16(VCC) IC21.16(VCC) IC22.16(VCC) IC23.16(VCC) IC24.16(VCC) IC25.16(VCC) IC26.16(VCC) IC27.16(VCC) JP1.9 JP2.9 JP3.9 JP4.9 JP5.9 JP6.9 JP7.9 JP8.9 JP9.9 JP10.9 JP11.9 JP12.9 JP13.9 JP100.1 JP100.2 R2K2_SCL.1 R2K2_SDA.1 RDHT-10K.2 RN1.1 RN2.1 RN3.1 RN4.1 RN5.1 RN6.1 RN7.1 RN8.1 RN9.1 RN10.1 RN11.1 RN12.1 RN13.1 SMPS_OUT.1 U1.8(VCC) U2.VDD U$1.5V U$2.VIN
VIN: U$1.VIN
WALL_NEUTRAL: J1.P$1 J4.P$1 L3.1
WALL_PHASE: J2.P$1 J3.P$1 L4.1
Unconnected: D15.6(C5) IC1.7(!QH) IC2.7(!QH) IC3.7(!QH) IC4.7(!QH) IC5.7(!QH) IC6.7(!QH) IC7.7(!QH) IC8.7(!QH) IC9.7(!QH) IC10.7(!QH) IC11.7(!QH) IC12.7(!QH) IC13.7(!QH) IC13.10(SER) IC14.10(SCL) IC15.P$2(NC) IC15.P$3(DTR) IC15.P$4(RI) IC15.P$5(DCD) IC15.P$6(NC) IC15.P$7(CTS) IC15.P$8(RTS) IC15.P$11(DISP_CLK) IC15.P$12(DISP_DATA) IC15.P$13(DISP_DC) IC15.P$14(DISP_CS) IC15.P$15(VDD_EXT) IC15.P$19(MIC_P) IC15.P$20(MIC_N) IC15.P$21(SPK_P) IC15.P$22(SPK_N) IC15.P$23(LINEIN_R) IC15.P$24(LINEIN_L) IC15.P$25(ADC) IC15.P$27(DBG_TXD) IC15.P$28(DBG_RXD) IC15.P$34(SIM_PRESENCE) IC15.P$35(PWM1) IC15.P$36(PWM2) IC15.P$37(SDA) IC15.P$38(SCL) IC15.P$40(GPIO1/KBR4) IC15.P$41(GPIO2/KBR3) IC15.P$42(GPIO3/KBR2) IC15.P$43(GPIO4/KBR1) IC15.P$44(GPIO5/KBR0) IC15.P$47(GPIO6/KBC4) IC15.P$48(GPIO7/KBC3) IC15.P$49(GPIO8/KBC2) IC15.P$50(GPIO9/KBC1) IC15.P$51(GPIO10) IC16.10(SCL) IC17.10(SCL) IC18.10(SCL) IC19.10(SCL) IC20.10(SCL) IC21.10(SCL) IC22.10(SCL) IC23.10(SCL) IC24.10(SCL) IC25.10(SCL) IC26.10(SCL) IC27.9(QH*) IC27.10(SCL) U1.7(SQW/OUT) U$1.3.3V U$1.AREF U$1.GND@2(GND) U$1.IOREF U$1.RES U$1.SCL U$1.SDA U$4.IO0 U$4.IO2 U$4.RST U$5.5(VPP)

## Buses
B$1
B$2
B$3
B$4
B$5
B$6
B$7
B$8
B$9